# EAGLE design vc8 (EAGLE 6.6.0)
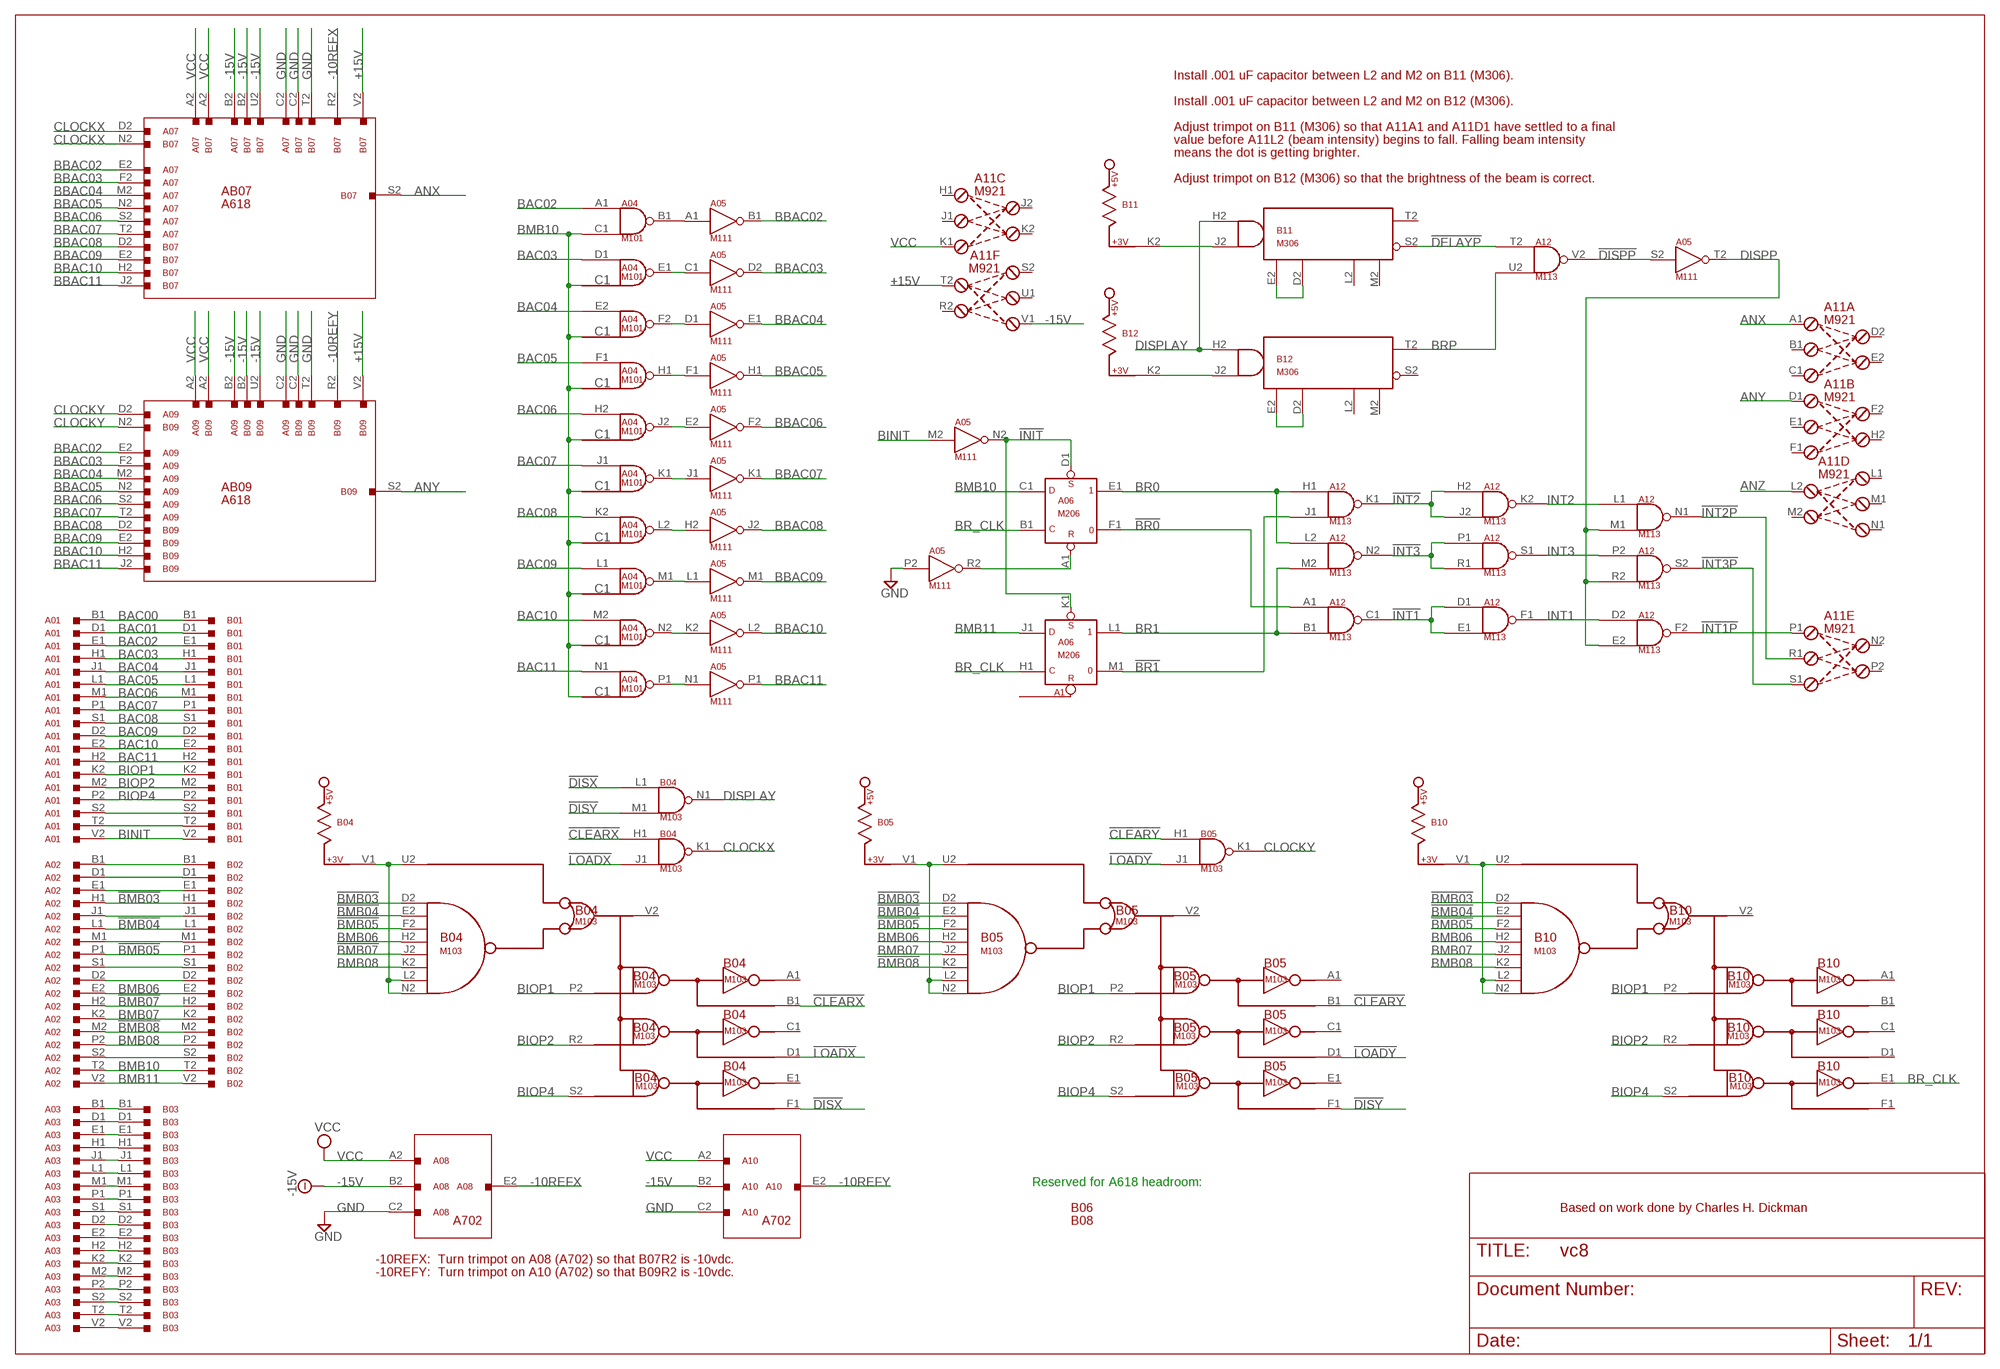
[diagram p0: schematic, sheet 1]

## Parts
A01  M903  [H807]
A02  M903  [H807]
A03  M903  [H807]
A04  M101  [H807]
A05  M111  [H807]
A06  M206  M206X  [H807]
A07  A618A  M916  [H807]
A08  A702  M916  [H807]
A09  A618A  M916  [H807]
A10  A702  M916  [H807]
A11  M921  [H807]
A12  M113  [H807]
B01  M903  [H807]
B02  M903  [H807]
B03  M903  [H807]
B04  M103  [H807]
B05  M103  [H807]
B06  EMPTY  [H807]
B07  A618B  M916  [H807]
B08  EMPTY  [H807]
B09  A618B  M916  [H807]
B10  M103  [H807]
B11  M306  [H807]
B12  M306  [H807]

## Nets
!BMB03: A02.H1 B02.H1 B04.D2(V2:D2) B05.D2(V2:D2) B10.D2(V2:D2)
!BMB04: A02.L1 B02.L1 B04.E2(V2:E2) B05.E2(V2:E2) B10.E2(V2:E2)
!BMB05: A02.P1 B02.P1 B04.F2(V2:F2) B05.F2(V2:F2) B10.F2(V2:F2)
!BMB07: A02.H2 B02.H2 B04.J2(V2:J2)
!BMB08: A02.M2 B02.M2 B05.K2(V2:K2)
!BR0: A06.F1 A12.A1(C1:IN1)
!BR1: A06.M1 A12.J1(K1:IN2)
!CLEARX: B04.B1(V2:B1) B04.H1(K1:IN1)
!CLEARY: B05.B1(V2:B1) B05.H1(K1:IN1)
!DELAYP: A12.T2(V2:IN1) B11.S2(S)
!DISPP: A05.S2(T2:IN) A12.V2(V2:OUT)
!DISX: B04.F1(V2:F1) B04.L1(N1:IN1)
!DISY: B04.M1(N1:IN2) B05.F1(V2:F1)
!INIT: A05.N2(N2:OUT) A06.D1(E1:S) A06.K1(L1:S)
!INT1: A12.C1(C1:OUT) A12.D1(F1:IN1) A12.E1(F1:IN2)
!INT1P: A11.P1(E:L1) A12.F2(F2:OUT)
!INT2: A12.H2(K2:IN1) A12.J2(K2:IN2) A12.K1(K1:OUT)
!INT2P: A11.R1(E:L2) A12.N1(N1:OUT)
!INT3: A12.N2(N2:OUT) A12.P1(S1:IN1) A12.R1(S1:IN2)
!INT3P: A11.S1(E:L3) A12.S2(S2:OUT)
!LOADX: B04.D1(V2:D1) B04.J1(K1:IN2)
!LOADY: B05.D1(V2:D1) B05.J1(K1:IN2)
+3VB04: B04.L2(V2:L2) B04.N2(V2:N2) B04.U2(V2:U2) B04.V1
+3VB05: B05.L2(V2:L2) B05.N2(V2:N2) B05.U2(V2:U2) B05.V1
+3VB10: B10.L2(V2:L2) B10.N2(V2:N2) B10.U2(V2:U2) B10.V1
+15V: A11.T2(F:R1) B07.V2 B09.V2
-10REFX: A08.E2 B07.R2
-10REFY: A10.E2 B09.R2
-15V: A07.B2 A08.B2 A09.B2 A10.B2 A11.V1(F:L3) B07.B2 B07.U2 B09.B2 B09.U2
ANX: A11.A1(A:L1) B07.S2
ANY: A11.D1(B:L1) B09.S2
ANZ: A11.L2(D:R1)
BAC00: A01.B1 B01.B1
BAC01: A01.D1 B01.D1
BAC02: A01.E1 A04.A1(B1:IN1) B01.E1
BAC03: A01.H1 A04.D1(E1:IN) B01.H1
BAC04: A01.J1 A04.E2(F2:IN) B01.J1
BAC05: A01.L1 A04.F1(H1:IN) B01.L1
BAC06: A01.M1 A04.H2(J2:IN) B01.M1
BAC07: A01.P1 A04.J1(K1:IN) B01.P1
BAC08: A01.S1 A04.K2(L2:IN) B01.S1
BAC09: A01.D2 A04.L1(M1:IN) B01.D2
BAC10: A01.E2 A04.M2(N2:IN) B01.E2
BAC11: A01.H2 A04.N1(P1:IN) B01.H2
BBAC02: A05.B1(B1:OUT) A07.E2 A09.E2
BBAC03: A05.D2(D2:OUT) A07.F2 A09.F2
BBAC04: A05.E1(E1:OUT) A07.M2 A09.M2
BBAC05: A05.H1(H1:OUT) A07.N2 A09.N2
BBAC06: A05.F2(F2:OUT) A07.S2 A09.S2
BBAC07: A05.K1(K1:OUT) A07.T2 A09.T2
BBAC08: A05.J2(J2:OUT) B07.D2 B09.D2
BBAC09: A05.M1(M1:OUT) B07.E2 B09.E2
BBAC10: A05.L2(L2:OUT) B07.H2 B09.H2
BBAC11: A05.P1(P1:OUT) B07.J2 B09.J2
BINIT: A01.V2 A05.M2(N2:IN) B01.V2
BIOP1: A01.K2 B01.K2 B04.P2(V2:P2) B05.P2(V2:P2) B10.P2(V2:P2)
BIOP2: A01.M2 B01.M2 B04.R2(V2:R2) B05.R2(V2:R2) B10.R2(V2:R2)
BIOP4: A01.P2 B01.P2 B04.S2(V2:S2) B05.S2(V2:S2) B10.S2(V2:S2)
BMB06: A02.E2 B02.E2 B04.H2(V2:H2) B05.H2(V2:H2) B10.H2(V2:H2)
BMB07: A02.K2 B02.K2 B05.J2(V2:J2) B10.J2(V2:J2)
BMB08: A02.P2 B02.P2 B04.K2(V2:K2) B10.K2(V2:K2)
BMB10: A02.T2 A04.C1(B1:IN2) A06.C1(E1:D) B02.T2
BMB11: A02.V2 A06.J1(L1:D) B02.V2
BR0: A06.E1 A12.H1(K1:IN1) A12.L2(N2:IN1)
BR1: A06.L1 A12.B1(C1:IN2) A12.M2(N2:IN2)
BR_CLK: A06.B1(E1:C) A06.H1(L1:C) B10.E1(V2:E1)
BRP: A12.U2(V2:IN2) B12.T2(T)
CLOCKX: A07.D2 B04.K1(K1:OUT) B07.N2
CLOCKY: A09.D2 B05.K1(K1:OUT) B09.N2
DISPLAY: B04.N1(N1:OUT) B11.H2(H) B12.H2(H)
DISPP: A05.T2(T2:OUT) A12.E2(F2:IN2) A12.M1(N1:IN2) A12.R2(S2:IN2)
GND: A05.P2(R2:IN) A07.C2 A08.C2 A09.C2 A10.C2 B07.C2 B07.T2 B09.C2 B09.T2
INT1: A12.D2(F2:IN1) A12.F1(F1:OUT)
INT2: A12.K2(K2:OUT) A12.L1(N1:IN1)
INT3: A12.P2(S2:IN1) A12.S1(S1:OUT)
N$1: A05.R2(R2:OUT) A06.A1(E1:R)
N$2: B11.J2(J) B11.K2
N$4: B12.J2(J) B12.K2
N$6: B11.D2(D) B11.E2(E)
N$7: B12.D2(D) B12.E2(E)
N$9: A04.B1(B1:OUT) A05.A1(B1:IN)
N$10: A04.E1(E1:OUT) A05.C1(D2:IN)
N$11: A04.F2(F2:OUT) A05.D1(E1:IN)
N$12: A04.H1(H1:OUT) A05.F1(H1:IN)
N$13: A04.J2(J2:OUT) A05.E2(F2:IN)
N$14: A04.P1(P1:OUT) A05.N1(P1:IN)
N$15: A04.N2(N2:OUT) A05.K2(L2:IN)
N$16: A04.M1(M1:OUT) A05.L1(M1:IN)
N$17: A04.L2(L2:OUT) A05.H2(J2:IN)
N$18: A04.K1(K1:OUT) A05.J1(K1:IN)
N$21: A03.B1 B03.B1
N$22: A03.D1 B03.D1
N$23: A03.E1 B03.E1
N$24: A03.H1 B03.H1
N$26: A03.J1 B03.J1
N$27: A03.L1 B03.L1
N$28: A03.M1 B03.M1
N$29: A03.P1 B03.P1
N$30: A03.S1 B03.S1
N$33: A03.D2 B03.D2
N$34: A03.E2 B03.E2
N$35: A03.H2 B03.H2
N$36: A03.K2 B03.K2
N$37: A03.M2 B03.M2
N$38: A03.P2 B03.P2
N$39: A03.S2 B03.S2
N$40: A03.T2 B03.T2
N$41: A03.V2 B03.V2
N$42: A02.D2 B02.D2
N$43: A02.S1 B02.S1
N$44: A02.J1 B02.J1
N$45: A02.M1 B02.M1
N$46: A02.S2 B02.S2
N$47: A02.B1 B02.B1
N$48: A02.D1 B02.D1
N$49: A02.E1 B02.E1
N$50: A01.T2 B01.T2
N$51: A01.S2 B01.S2
VCC: A07.A2 A08.A2 A09.A2 A10.A2 A11.K1(C:L3) B07.A2 B09.A2
Unconnected: A04.P2(R2:IN) A04.R1(S1:IN) A04.R2(R2:OUT) A04.S1(S1:OUT) A04.S2(T2:IN) A04.T2(T2:OUT) A04.U1(U1:OUT) A04.U2(V2:IN) A04.V1(U1:IN) A04.V2(V2:OUT) A05.R1(S1:IN) A05.S1(S1:OUT) A05.U1(U1:OUT) A05.U2(V2:IN) A05.V1(U1:IN) A05.V2(V2:OUT) A06.D2(H2:C) A06.E2(H2:D) A06.F2(H2:S) A06.H2 A06.J2 A06.K2(P2:R) A06.L2(P2:C) A06.M2(P2:D) A06.N1(S1:C) A06.N2(P2:S) A06.P1(S1:D) A06.P2 A06.R1(S1:S) A06.R2 A06.S1 A06.S2(V2:C) A06.T2(V2:D) A06.U1 A06.U2(V2:S) A06.V1 A06.V2 A07.A1 A07.B1 A07.C1 A07.D1 A07.E1 A07.F1 A07.H1 A07.H2 A07.J1 A07.J2 A07.K1 A07.K2 A07.L1 A07.L2 A07.M1 A07.N1 A07.P1 A07.P2 A07.R1 A07.R2 A07.S1 A07.T1 A07.U1 A07.U2 A07.V1 A07.V2 A08.A1 A08.B1 A08.C1 A08.D1 A08.D2 A08.E1 A08.F1 A08.F2 A08.H1 A08.H2 A08.J1 A08.J2 A08.K1 A08.K2 A08.L1 A08.L2 A08.M1 A08.M2 A08.N1 A08.N2 A08.P1 A08.P2 A08.R1 A08.R2 A08.S1 A08.S2 A08.T1 A08.T2 A08.U1 A08.U2 A08.V1 A08.V2 A09.A1 A09.B1 A09.C1 A09.D1 A09.E1 A09.F1 A09.H1 A09.H2 A09.J1 A09.J2 A09.K1 A09.K2 A09.L1 A09.L2 A09.M1 A09.N1 A09.P1 A09.P2 A09.R1 A09.R2 A09.S1 A09.T1 A09.U1 A09.U2 A09.V1 A09.V2 A10.A1 A10.B1 A10.C1 A10.D1 A10.D2 A10.E1 A10.F1 A10.F2 A10.H1 A10.H2 A10.J1 A10.J2 A10.K1 A10.K2 A10.L1 A10.L2 A10.M1 A10.M2 A10.N1 A10.N2 A10.P1 A10.P2 A10.R1 A10.R2 A10.S1 A10.S2 A10.T1 A10.T2 A10.U1 A10.U2 A10.V1 A10.V2 A11.B1(A:L2) A11.C1(A:L3) A11.D2(A:R1) A11.E1(B:L2) A11.E2(A:R2) A11.F1(B:L3) A11.F2(B:R1) A11.H1(C:L1) A11.H2(B:R2) A11.J1(C:L2) A11.J2(C:R1) A11.K2(C:R2) A11.L1(D:L1) A11.M1(D:L2) A11.M2(D:R2) A11.N1(D:L3) A11.N2(E:R1) A11.P2(E:R2) A11.R2(F:R2) A11.S2(F:L1) A11.U1(F:L2) A12.U1 A12.V1 B04.A1(V2:A1) B04.C1(V2:C1) B04.E1(V2:E1) B04.V2(V2:V2) B05.A1(V2:A1) B05.C1(V2:C1) B05.E1(V2:E1) B05.L1(N1:IN1) B05.M1(N1:IN2) B05.N1(N1:OUT) B05.V2(V2:V2) B07.A1 B07.B1 B07.C1 B07.D1 B07.E1 B07.F1 B07.F2 B07.H1 B07.J1 B07.K1 B07.K2 B07.L1 B07.L2 B07.M1 B07.M2 B07.N1 B07.P1 B07.P2 B07.R1 B07.S1 B07.T1 B07.U1 B07.V1 B09.A1 B09.B1 B09.C1 B09.D1 B09.E1 B09.F1 B09.F2 B09.H1 B09.J1 B09.K1 B09.K2 B09.L1 B09.L2 B09.M1 B09.M2 B09.N1 B09.P1 B09.P2 B09.R1 B09.S1 B09.T1 B09.U1 B09.V1 B10.A1(V2:A1) B10.B1(V2:B1) B10.C1(V2:C1) B10.D1(V2:D1) B10.F1(V2:F1) B10.H1(K1:IN1) B10.J1(K1:IN2) B10.K1(K1:OUT) B10.L1(N1:IN1) B10.M1(N1:IN2) B10.N1(N1:OUT) B10.V2(V2:V2) B11.L2(L) B11.M2(M) B11.T2(T) B12.L2(L) B12.M2(M) B12.S2(S)

## Notes on the sheet
- Install .001 uF capacitor between L2 and M2 on B11 (M306).
- Install .001 uF capacitor between L2 and M2 on B12 (M306).
- Adjust trimpot on B11 (M306) so that A11A1 and A11D1 have settled to a final
- value before A11L2 (beam intensity) begins to fall. Falling beam intensity
- means the dot is getting brighter.
- Adjust trimpot on B12 (M306) so that the brightness of the beam is correct.
- AB07
- A618
- AB09
- A618
- Reserved for A618 headroom:
- Based on work done by Charles H. Dickman
- A702 | A702
- -10REFX:  Turn trimpot on A08 (A702) so that B07R2 is -10vdc.
- -10REFY:  Turn trimpot on A10 (A702) so that B09R2 is -10vdc.

## Power pins joined to a net without a drawn wire
-15V: B06.B2 B08.B2
GND: A01.A1 A01.C1 A01.C2 A01.F1 A01.F2 A01.J2 A01.K1 A01.L2 A01.N1 A01.N2 A01.R1 A01.R2 A01.T1 A01.U2 A02.A1 A02.C1 A02.C2 A02.F1 A02.F2 A02.J2 A02.K1 A02.L2 A02.N1 A02.N2 A02.R1 A02.R2 A02.T1 A02.U2 A03.A1 A03.C1 A03.C2 A03.F1 A03.F2 A03.J2 A03.K1 A03.L2 A03.N1 A03.N2 A03.R1 A03.R2 A03.T1 A03.U2 A04.C2(GND) A04.T1(GND) A05.C2(GND) A05.T1(GND) A06.C2(GND) A06.T1(GND) A12.C2(GND) A12.T1(GND) B01.A1 B01.C1 B01.C2 B01.F1 B01.F2 B01.J2 B01.K1 B01.L2 B01.N1 B01.N2 B01.R1 B01.R2 B01.T1 B01.U2 B02.A1 B02.C1 B02.C2 B02.F1 B02.F2 B02.J2 B02.K1 B02.L2 B02.N1 B02.N2 B02.R1 B02.R2 B02.T1 B02.U2 B03.A1 B03.C1 B03.C2 B03.F1 B03.F2 B03.J2 B03.K1 B03.L2 B03.N1 B03.N2 B03.R1 B03.R2 B03.T1 B03.U2 B04.C2(GND) B04.T1(GND) B05.C2(GND) B05.T1(GND) B06.C2 B08.C2 B10.C2(GND) B10.T1(GND) B11.C2(GND) B12.C2(GND)
VCC: A04.A2(VCC) A05.A2(VCC) A06.A2(VCC) A12.A2(VCC) B04.A2(VCC) B05.A2(VCC) B06.A2 B08.A2 B10.A2(VCC) B11.A2(VCC) B12.A2(VCC)

## Library data of the parts
A01-A03 B01-B03 = dec-m:M903: Two-sided Posibus cable/connector.
A04 = dec-m:M101: Bus Data Interface The M101 contains 15 two-input NAND gates. One input of each gate is tied to a common line so that all data signals can be enabled simultaneously. Each data signal presents one TTL load. The common input presents 15 loads. Each output can drive 10 loads. Power: 5V@82ma (max.)
A05 = dec-m:M111: Sixteen inverters.
A06 = dec-m:M206X: Two sets of 3 D flip-flops
A07-A09 A10 B07 B09 = dec-m:M916: Simple 36 pin connector/wire cable
A11 = dec-m:M921: Device Code Select Jumper Board
A12 = dec-m:M113: 10 2-input NAND Gates
B04 B05 B10 = dec-m:M103: M103 Device Selector Used to decode IOT requests.
B06 B08 = dec-m:EMPTY: Empty Slot
B11 B12 = dec-m:M306: M306 Integrating One-Shot

## Net classes
1 Supply: width 0.635 mm

## Board
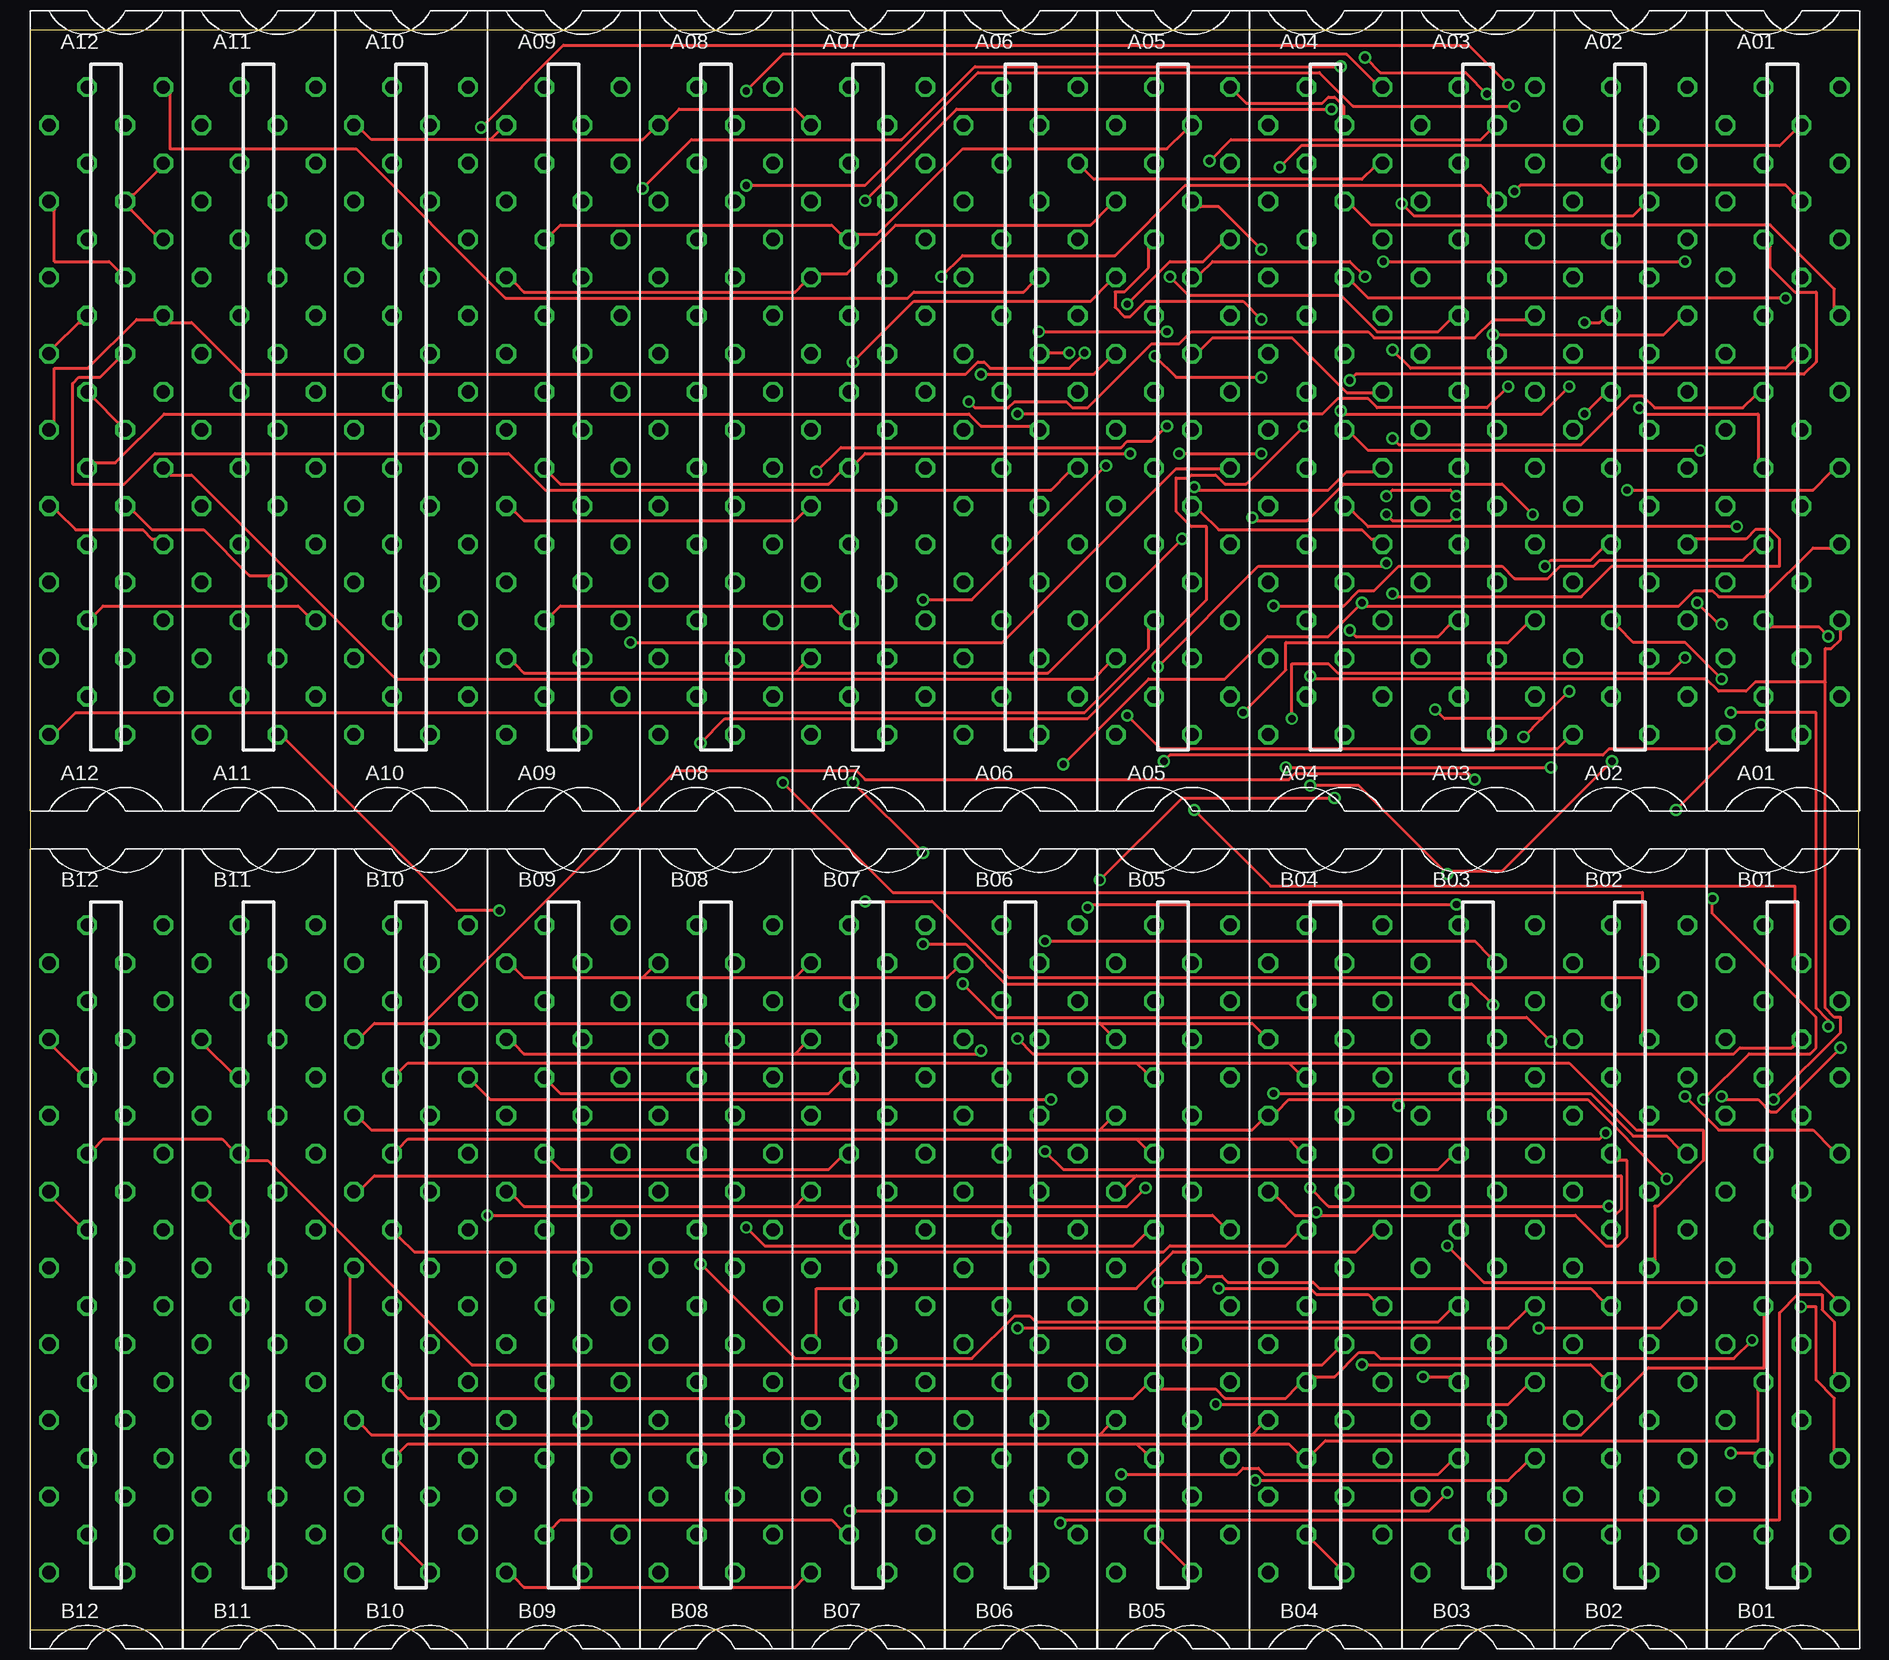
[diagram p1: board, top side]
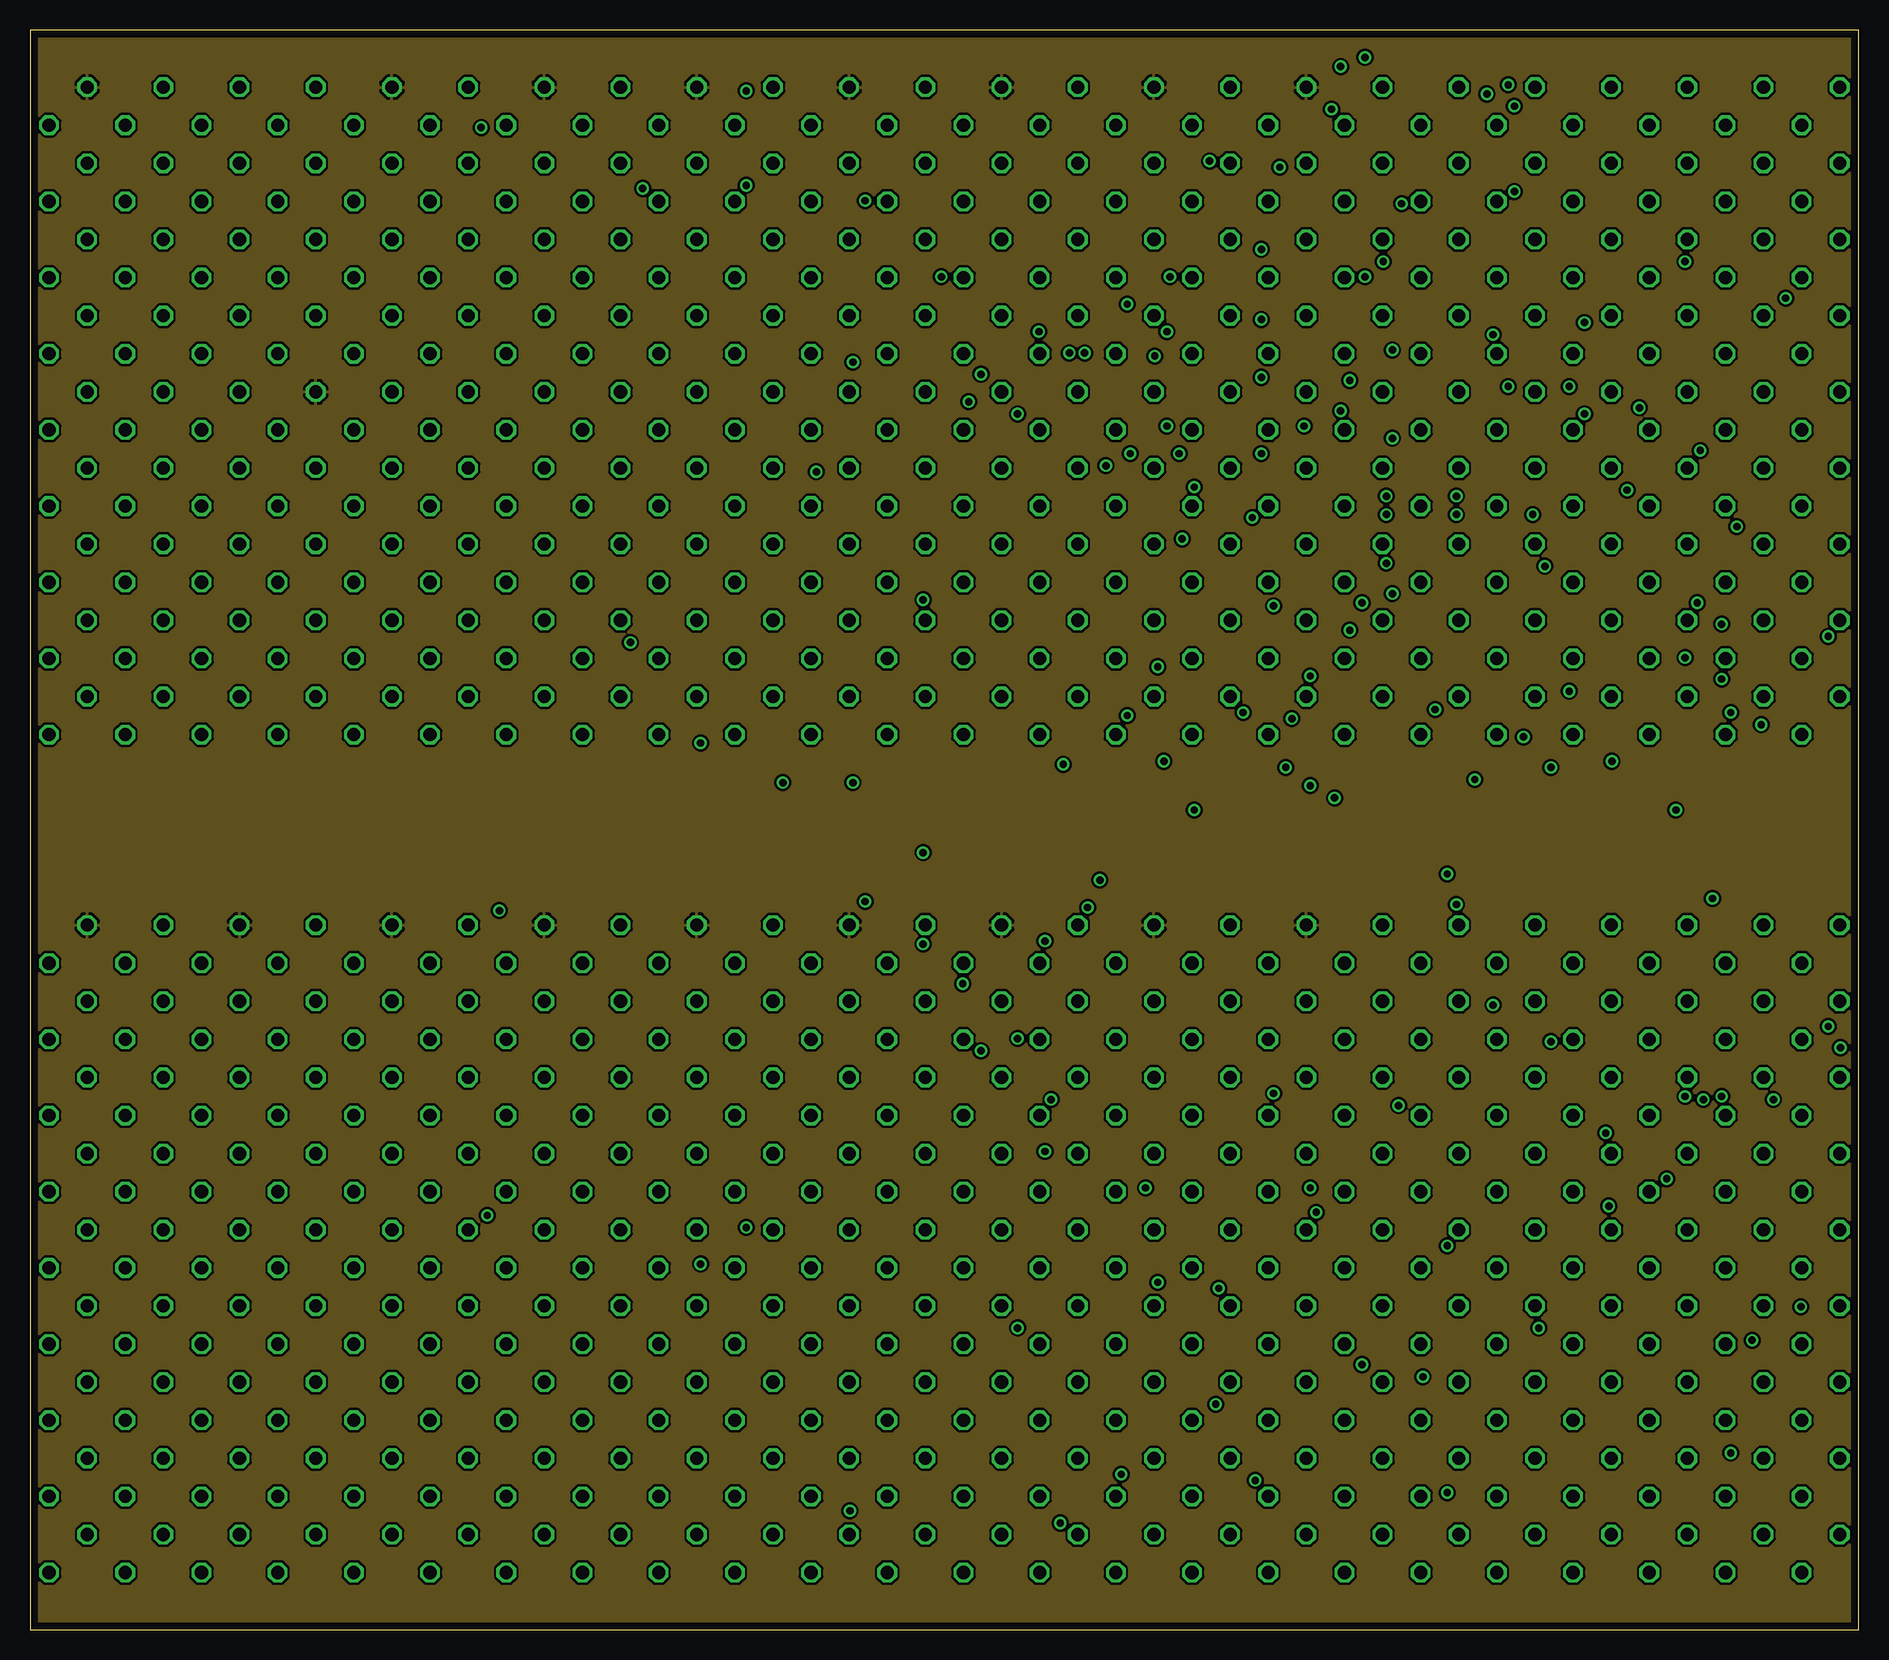
[diagram p2: board, inner layer vcc$]
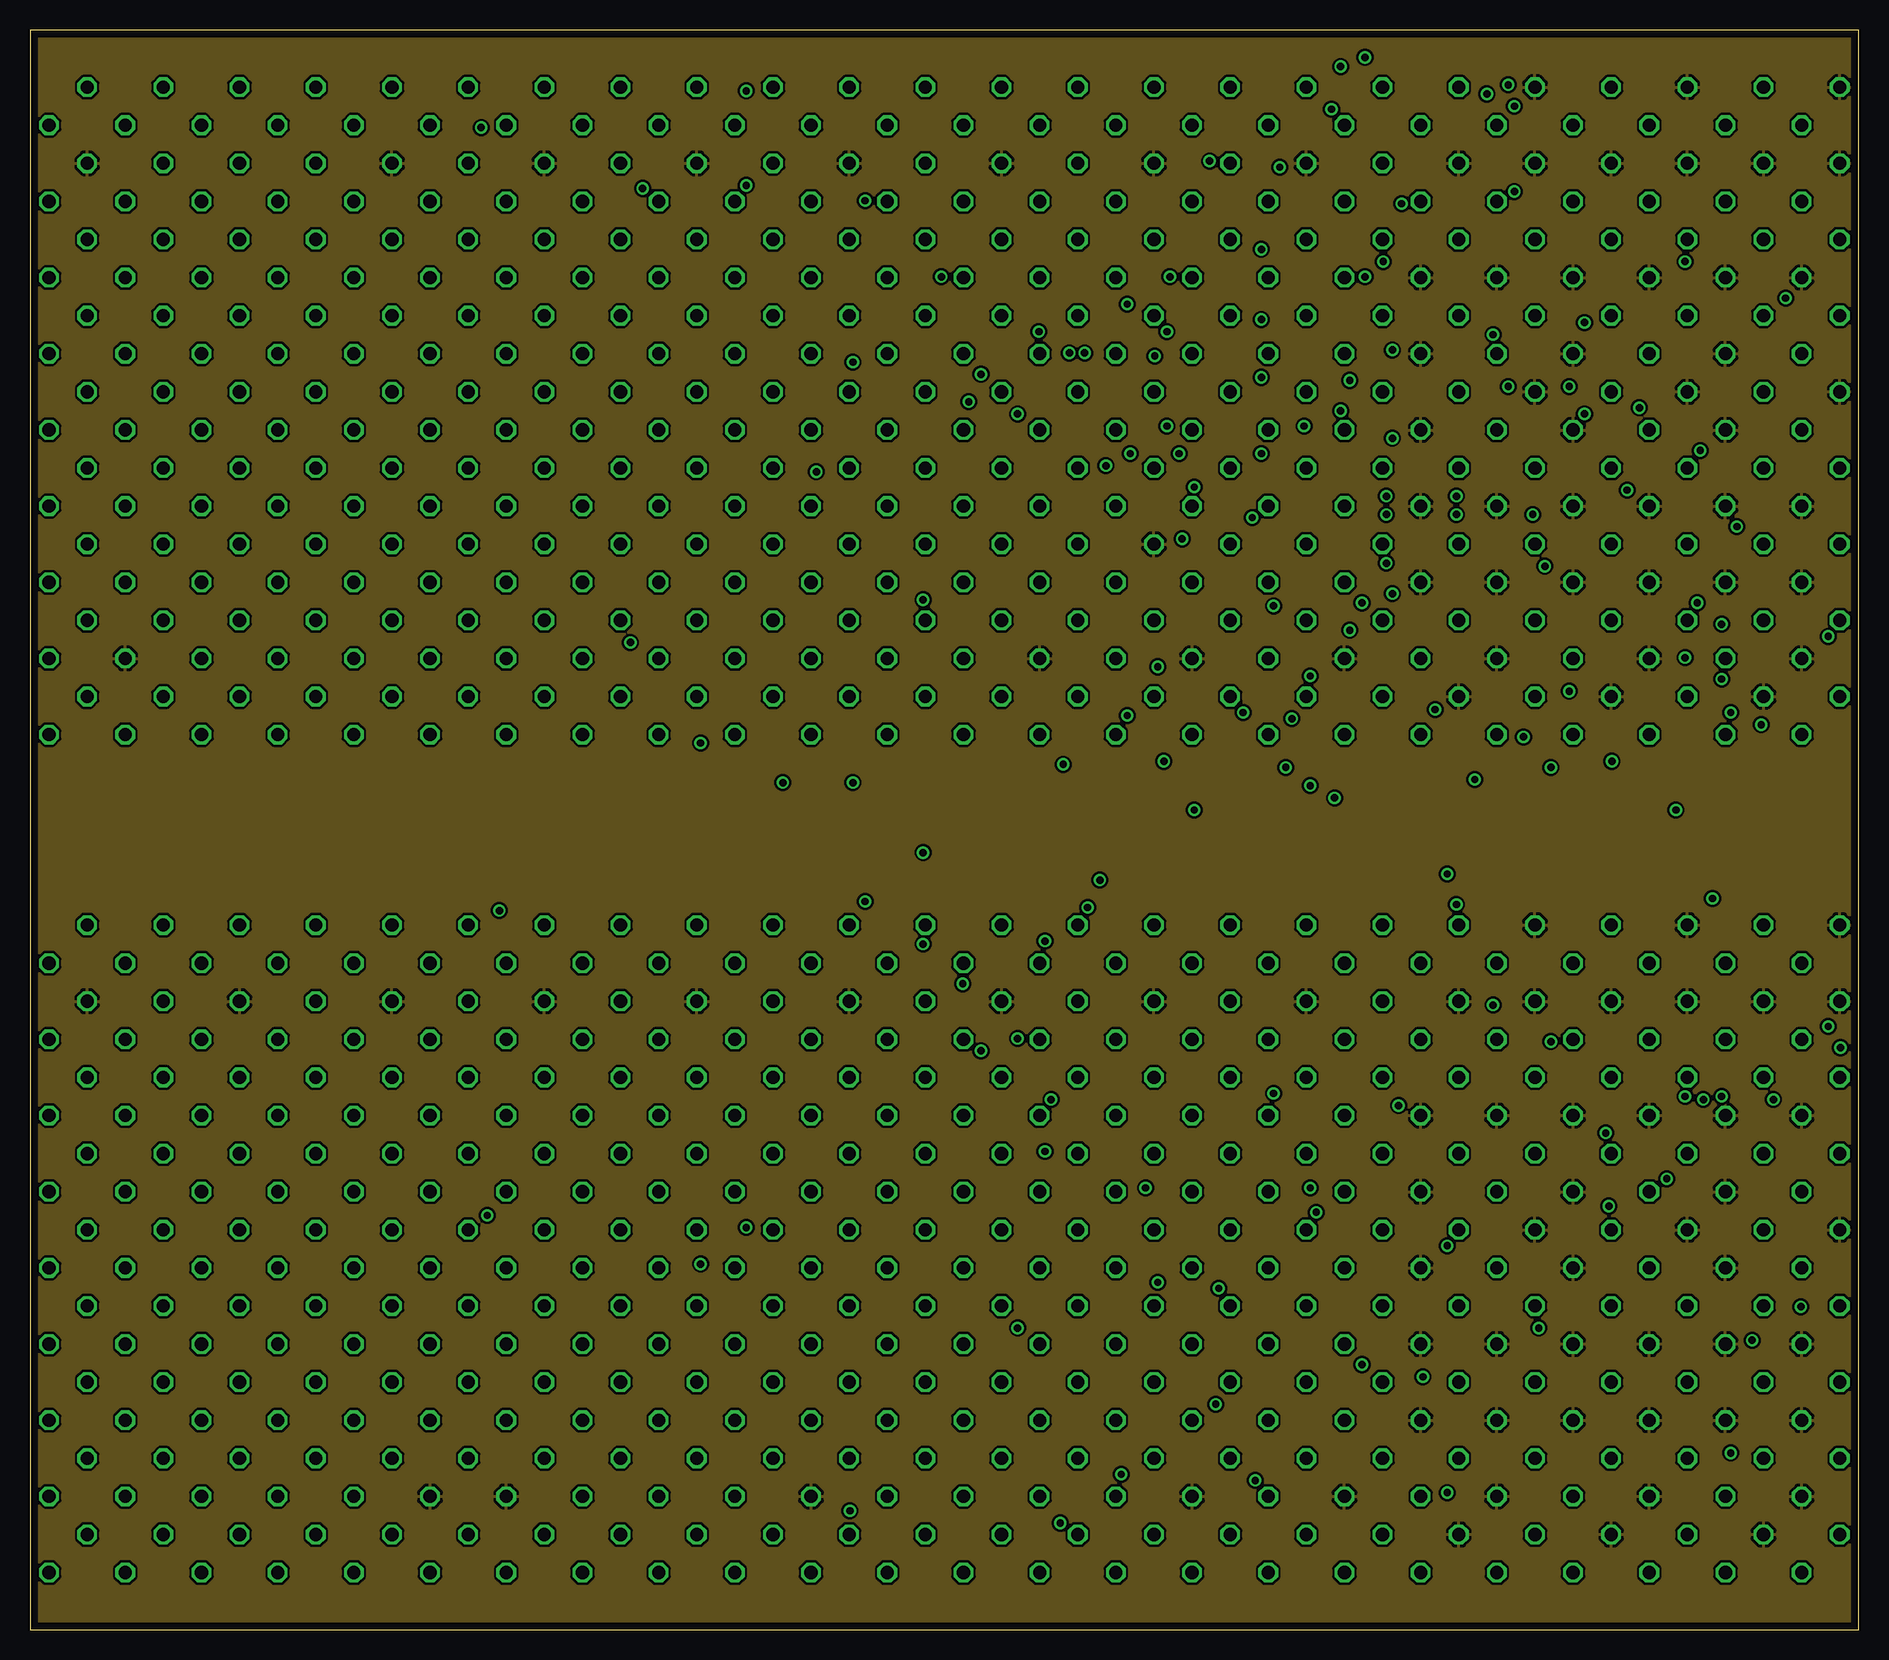
[diagram p3: board, inner layer gnd$]
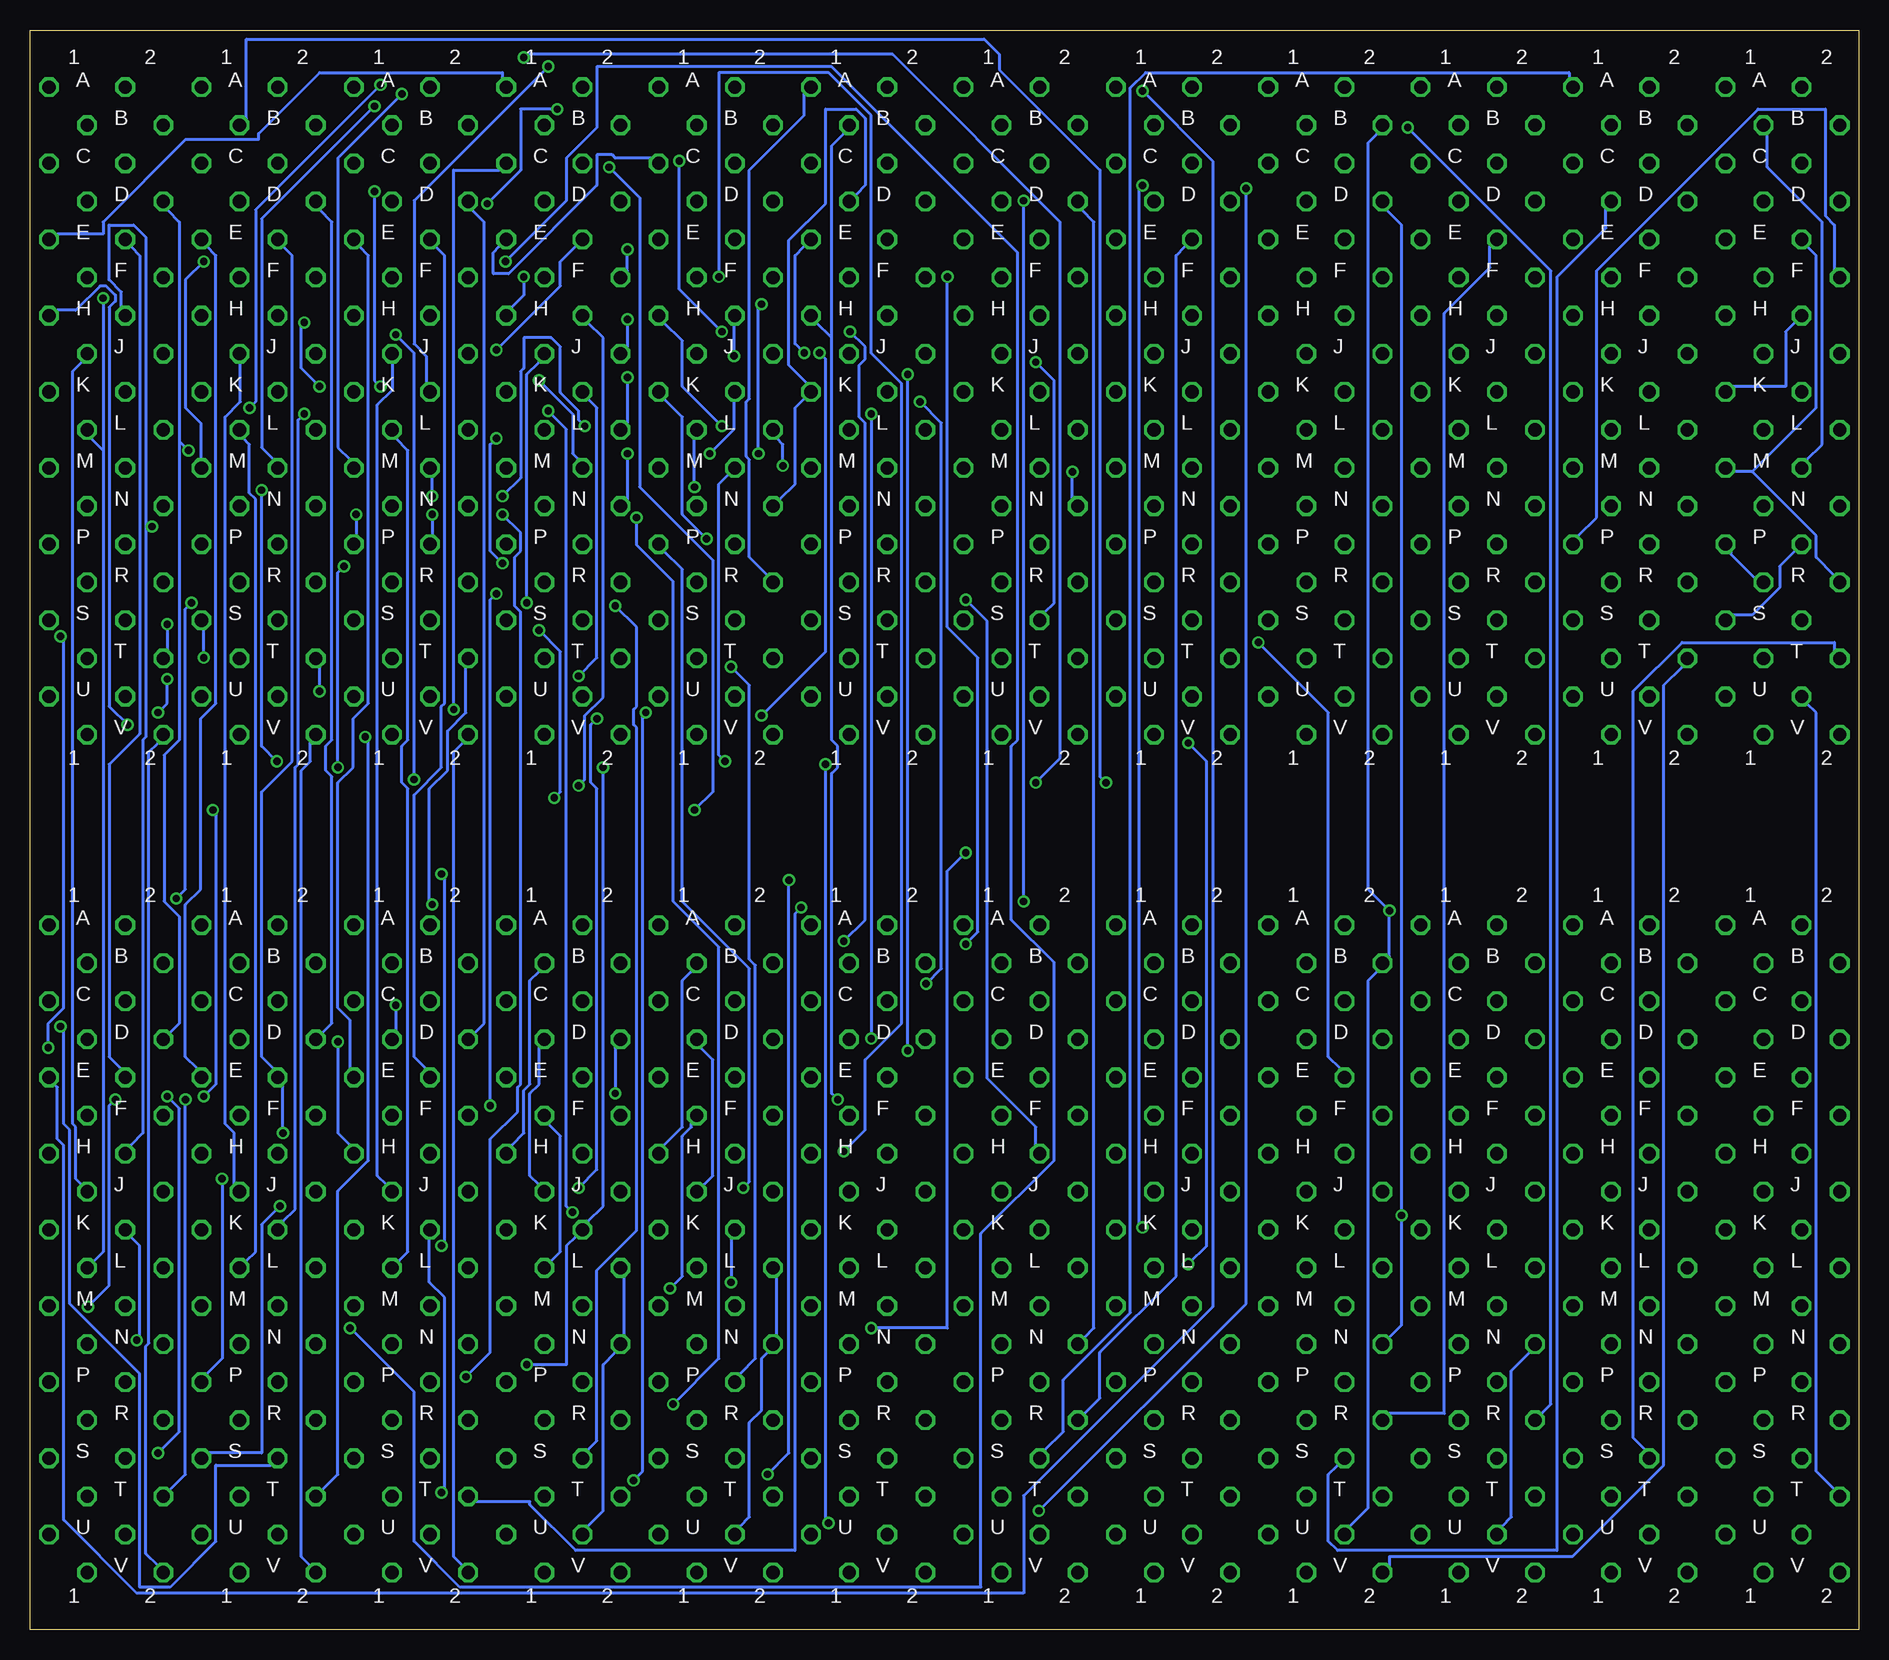
[diagram p4: board, bottom side, seen from below]

Size 152.4 x 133.35 mm. Coordinates in mm from the lower left corner, seen from the top.
Outline: 0,0 152.4,0 152.4,133.35 0,133.35 0,0
Copper layers (1*2*15*16): Top 0.035mm / dielectric 1.5mm / vcc$ 0.035mm / dielectric 0.15mm / gnd$ 0.035mm / dielectric 0.2mm / Bottom 0.035mm
Design rules "custompcb *": minimum track width 10mil, minimum drill 24mil, track to track 8mil, track to pad 8mil, pad to pad 8mil, via to via 8mil, smd to smd 0mil, copper to edge 25mil, drill to drill 8mil, minimum pad ring 10mil, minimum via ring 8mil, stop-mask expansion 4mil, vias tented up to drill 0mil, thermal gap 10mil

### Footprints (pad centres in the part's own frame; a part is rotated, then mirrored left to right if it is on the bottom)
H807 = drill 1.092 octagon: A1 4.763,28.575; A2 -1.587,28.575; B1 1.587,25.4; B2 -4.763,25.4; C1 4.763,22.225; C2 -1.587,22.225; D1 1.587,19.05; D2 -4.763,19.05; E1 4.763,15.875; E2 -1.587,15.875; F1 1.587,12.7; F2 -4.763,12.7; H1 4.763,9.525; H2 -1.587,9.525; J1 1.587,6.35; J2 -4.763,6.35; K1 4.763,3.175; K2 -1.587,3.175; L1 1.587,0; L2 -4.763,0; M1 4.763,-3.175; M2 -1.587,-3.175; N1 1.587,-6.35; N2 -4.763,-6.35; P1 4.763,-9.525; P2 -1.587,-9.525; R1 1.587,-12.7; R2 -4.763,-12.7; S1 4.763,-15.875; S2 -1.587,-15.875; T1 1.587,-19.05; T2 -4.763,-19.05; U1 4.763,-22.225; U2 -1.587,-22.225; V1 1.587,-25.4; V2 -4.763,-25.4

### Placement (x,y rotation side)
A01  146.05,100.01 0 top
A02  133.35,100.01 0 top
A03  120.65,100.01 0 top
A04  107.95,100.01 0 top
A05  95.25,100.01 0 top
A06  82.55,100.01 0 top
A07  69.85,100.01 0 top
A08  57.15,100.01 0 top
A09  44.45,100.01 0 top
A10  31.75,100.01 0 top
A11  19.05,100.01 0 top
A12  6.35,100.01 0 top
B01  146.05,30.16 0 top
B02  133.35,30.16 0 top
B03  120.65,30.16 0 top
B04  107.95,30.16 0 top
B05  95.25,30.16 0 top
B06  82.55,30.16 0 top
B07  69.85,30.16 0 top
B08  57.15,30.16 0 top
B09  44.45,30.16 0 top
B10  31.75,30.16 0 top
B11  19.05,30.16 0 top
B12  6.35,30.16 0 top

### Tracks (layer width: path | path; a pad name or v marks a point on that pad's centre or on a via)
!BMB03  (via drill 0.61)
  Top 0.254: 32.77,50.55 89.15,50.55 | 32.77,50.55 28.7,50.55 27.69,49.53 B10.D2 | 89.15,50.55 89.92,49.78 B05.D2 | 89.15,50.55 101.85,50.55 102.62,49.78 B04.D2 | v103.63,44.7 130.05,44.7 133.6,41.15 136.4,41.15 137.41,40.13 B02.H1 | v121.92,107.95 136.14,107.95 137.41,109.22 A02.H1 | v120.4,70.87 119.89,71.37 105.41,71.37 104.9,70.87 69.6,70.87 68.83,71.63 53.85,71.63 32.77,50.55
  Bottom 0.254: v103.63,44.7 103.63,48.51 B04.D2 | v121.92,107.95 120.4,106.43 v120.4,70.87
!BMB04
  Top 0.254: 92.2,47.24 31.5,47.24 30.73,46.48 B10.E2 | 92.2,47.24 92.96,46.48 B05.E2 | 104.9,47.24 105.66,46.48 B04.E2 | 92.2,47.24 104.9,47.24 | 104.9,47.24 128.27,47.24 133.86,41.66 139.45,41.66 139.45,39.12 135.64,35.31 135.38,35.31 135.38,30.73 B02.L1
  Bottom 0.254: A02.L1 134.62,99.31 134.11,98.81 134.11,94.74 133.6,94.23 133.6,31.5 134.37,30.73 B02.L1
!BMB05  (via drill 0.61)
  Top 0.254: 89.15,41.66 28.45,41.66 27.69,42.42 B10.F2 | 89.15,41.66 89.92,42.42 B05.F2 | 89.15,41.66 101.85,41.66 102.62,42.42 B04.F2 103.89,43.18 104.9,44.2 114.05,44.2 | v136.4,37.59 129.79,44.2 114.05,44.2 | v113.54,86.36 113.79,86.11 129.29,86.11 131.83,88.65 145.8,88.65 145.8,90.93 145.03,91.69 143.76,91.69 143,90.93 138.68,90.93 A02.P1 | 114.05,44.2 v114.05,43.69
  Bottom 0.254: v136.4,37.59 136.4,22.61 137.67,21.34 B02.P1 | v113.54,86.36 114.05,85.85 v114.05,43.69
!BMB07  (via drill 0.61)
  Top 0.254: 107.19,34.54 128.78,34.54 131.32,32 132.33,32 133.1,32.77 133.1,39.12 132.33,39.12 B02.H2 | 107.19,34.54 105.41,34.54 103.89,36.07 B04.J2 | v129.54,108.97 130.81,108.97 131.06,109.22 A02.H2 | v128.27,103.63 125.98,101.35 109.47,101.35 v109.22,101.6 | 107.19,34.54 v107.19,34.8
  Bottom 0.254: v129.54,108.97 129.79,108.71 129.79,105.16 v128.27,103.63 | v109.22,101.6 107.7,100.08 107.7,35.31 v107.19,34.8
!BMB08  (via drill 0.61)
  Top 0.254: v93.98,28.96 97.54,28.96 98.04,29.46 99.31,29.46 99.82,28.96 106.93,28.96 107.44,28.45 130.05,28.45 131.06,27.43 B02.M2 | v123.7,127 110.24,127 107.44,129.79 78.99,129.79 69.6,120.4 v59.69,120.4 | v59.69,33.53 61.21,32 91.95,32 92.96,33.02 B05.K2
  Bottom 0.254: v93.98,28.96 93.98,32.77 B05.K2 | v123.7,127 133.1,117.6 133.1,98.55 132.08,97.54 A02.M2 | v59.69,120.4 59.94,120.14 59.94,33.78 v59.69,33.53
!BR0
  Top 0.254: A12.A1 11.68,128.02 11.68,123.44 27.18,123.44 39.62,111 73.15,111 73.66,111.51 82.8,111.51 83.57,112.27 A06.F1
!BR1
  Top 0.254: A12.J1 7.37,105.92 5.84,104.39 4.06,104.39 3.56,103.89 3.56,95.5 7.87,95.5 10.41,98.04 39.88,98.04 42.93,95 85.09,95 86.61,96.52 A06.M1
!CLEARX
  Bottom 0.254: B04.H1 112.27,40.39 111.25,41.4 111.25,44.96 110.74,45.47 110.74,54.1 109.98,54.86 B04.B1
!CLEARY
  Bottom 0.254: B05.H1 99.57,40.39 98.04,41.91 98.04,54.1 97.28,54.86 B05.B1
!DELAYP
  Bottom 0.254: B11.S2 17.78,14.99 18.8,16 18.8,78.23 14.73,82.3 2.03,82.3 2.03,81.53 A12.T2
!DISPP
  Top 0.254: A12.V2 2.29,74.93 3.81,76.45 87.88,76.45 93.22,81.79 93.22,83.57 A05.S2
!DISX
  Bottom 0.254: B04.L1 108.97,30.73 108.2,31.5 108.2,41.15 109.22,42.16 B04.F1
!DISY  (via drill 0.61)
  Top 0.254: v99.06,28.45 106.68,28.45 107.19,27.94 111.51,27.94 112.01,27.43 B04.M1
  Bottom 0.254: v99.06,28.45 98.04,29.46 98.04,41.15 97.28,41.91 97.28,42.16 B05.F1
!INIT
  Bottom 0.254: A05.N2 89.92,94.23 88.65,95.5 88.65,101.85 87.88,102.62 A06.K1 87.63,103.89 89.15,105.41 89.15,115.82 86.11,118.87 86.11,126.75 83.57,126.75 82.8,125.98 82.8,120.4 83.57,119.63 A06.D1
!INT1
  Top 0.254: A12.E1 10.41,116.33 8.38,118.36 A12.D1 8.38,119.63 8.64,119.63 10.67,121.67 A12.C1
!INT1P
  Bottom 0.254: A11.P1 23.37,91.19 21.84,92.71 21.84,113.28 8.38,126.75 2.79,126.75 2.79,117.86 2.03,117.09 2.03,113.28 A12.F2
!INT2
  Top 0.254: A12.J2 2.03,106.93 4.06,108.97 4.32,108.97 A12.H2
  Bottom 0.254: A12.K1 10.41,103.63 6.1,103.63 6.1,108.2 5.33,108.97 A12.H2
!INT2P
  Top 0.254: A12.N1 8.64,93.22 10.16,91.69 14.48,91.69 18.29,87.88 20.07,87.88 A11.R1
!INT3
  Top 0.254: A12.N2 2.29,93.22 3.81,91.69 9.4,91.69 10.16,90.93 10.41,90.93 A12.P1
  Bottom 0.254: A12.R1 8.64,87.63 10.67,89.66 10.67,89.92 A12.P1
!INT3P
  Top 0.254: A12.S2 5.33,84.58 6.1,85.34 22.35,85.34 23.11,84.58 A11.S1
!LOADX
  Bottom 0.254: B04.J1 109.98,37.08 110.74,37.85 110.74,44.7 109.98,45.47 109.98,48.51 B04.D1
!LOADY
  Bottom 0.254: B05.J1 96.27,37.08 95.5,37.85 95.5,47.5 96.52,48.51 B05.D1
+3VB04
  Top 0.254: B04.U2 106.93,7.37 108.97,5.33 B04.V1
  Bottom 0.254: B04.L2 102.87,29.46 102.87,24.38 B04.N2 103.63,23.11 104.65,22.1 104.65,9.91 105.92,8.64 B04.U2
+3VB05
  Top 0.254: B05.U2 94.23,7.37 96.27,5.33 B05.V1
  Bottom 0.254: B05.L2 90.17,29.46 90.17,24.38 B05.N2 90.93,23.11 91.44,22.61 91.44,18.29 92.46,17.27 92.46,9.4 93.22,8.64 B05.U2
+3VB10
  Top 0.254: B10.N2 26.67,24.38 26.67,29.46 B10.L2 | B10.U2 30.73,7.37 32.77,5.33 B10.V1
  Bottom 0.254: B10.N2 27.43,23.11 28.96,21.59 28.96,9.4 29.72,8.64 B10.U2
+15V
  Top 0.254: B09.V2 40.39,4.32 41.15,3.56 63.75,3.56 64.52,4.32 B07.V2
  Bottom 0.254: A11.T2 14.73,80.26 16.26,78.74 16.26,13.72 23.88,6.1 39.12,6.1 39.12,5.33 B09.V2
-10REFX
  Bottom 0.254: B07.R2 64.52,18.03 63.25,19.3 63.25,23.11 56.9,29.46 56.9,114.55 56.13,115.32 A08.E2
-10REFY
  Bottom 0.254: B09.R2 39.12,18.03 34.54,18.03 34.54,109.73 30.73,113.54 30.73,115.32 A10.E2
-15V  (via drill 0.61)
  Top 0.254: 38.35,124.21 28.45,124.21 27.69,124.97 A10.B2 | 38.35,124.21 39.12,124.97 A09.B2 | 38.35,124.21 51.05,124.21 51.82,124.97 A08.B2 53.09,125.73 54.1,126.75 63.75,126.75 64.52,125.98 A07.B2 | B09.U2 43.43,8.38 44.2,9.14 66.8,9.14 67.56,8.38 B07.U2 | 51.05,54.36 41.15,54.36 40.39,55.12 B09.B2 | 51.05,54.36 51.82,55.12 B08.B2 | 63.75,54.36 64.52,55.12 B07.B2 | 51.05,54.36 63.75,54.36 | 63.75,54.36 76.45,54.36 77.22,55.12 B06.B2 | v39.12,59.94 35.56,59.94 21.34,74.17 A11.V1
  Bottom 0.254: B09.U2 42.42,8.64 40.89,10.16 40.89,54.1 40.13,54.86 B09.B2 39.12,56.13 v39.12,59.94 39.37,60.2 40.89,61.72 40.89,123.95 40.13,124.71 A09.B2
ANX
  Bottom 0.254: B07.S2 67.82,14.99 66.29,16.51 66.29,20.83 60.71,26.42 60.71,128.52 59.44,129.79 24.13,129.79 24.13,129.29 A11.A1
ANY
  Bottom 0.254: B09.S2 43.43,13.72 44.2,12.95 44.2,7.37 43.43,6.6 25.15,6.6 25.15,112.78 21.08,116.84 21.08,118.36 A11.D1
BAC00  (via drill 0.61)
  Top 0.254: v97.03,68.33 103.38,61.98 147.07,61.98 147.07,56.13 B01.B1 | v104.14,121.92 105.92,123.7 145.8,123.7 147.07,124.97 A01.B1
  Bottom 0.254: v97.03,68.33 95.5,69.85 95.5,89.15 101.6,95.25 101.6,119.38 v104.14,121.92
BAC01  (via drill 0.61)
  Top 0.254: v82.3,49.28 83.57,48.01 141.99,48.01 142.49,48.51 146.81,48.51 147.07,48.77 B01.D1 | v82.3,101.35 107.7,101.35 108.97,102.62 111.51,102.62 112.27,101.85 121.41,101.85 v123.19,103.63 | v123.7,119.89 124.21,120.4 146.3,120.4 147.07,119.63 A01.D1
  Bottom 0.254: v82.3,101.35 v82.3,49.28 | v123.19,103.63 123.7,104.14 v123.7,119.89
BAC02  (via drill 0.61)
  Top 0.254: v59.69,128.27 62.74,131.32 109.73,131.32 112.01,129.03 A04.A1
  Bottom 0.254: v59.69,128.27 53.85,122.43 53.85,26.92 69.6,11.18 69.6,3.05 143.51,3.05 149.61,9.14 149.61,40.39 150.11,40.89 150.11,45.21 150.37,45.47 B01.E1 | A01.E1 150.11,116.33 146.3,116.33 146.3,117.35 139.45,124.21 133.35,124.21 133.35,124.71 128.27,129.79 113.03,129.79 113.03,129.29 A04.A1
BAC03  (via drill 0.61)
  Top 0.254: v137.92,44.45 140.72,41.66 148.59,41.66 150.11,40.13 B01.H1 | v144.27,75.44 v137.16,68.33 | A04.D1 110.24,118.62 111.76,117.09 145.03,117.09 150.37,111.76 150.37,110.24 A01.H1
  Bottom 0.254: v137.92,44.45 136.91,45.47 136.91,68.07 v137.16,68.33 | v144.27,75.44 145.8,76.96 145.8,110.24 145.29,110.74 145.29,111.25 146.05,112.01 146.56,112.01 148.59,109.98 150.11,109.98 A01.H1
BAC04  (via drill 0.61)
  Top 0.254: v113.54,106.68 115.06,105.16 146.3,105.16 147.07,105.92 A01.J1
  Bottom 0.254: B01.J1 148.08,37.08 148.59,37.59 148.59,41.91 148.84,42.16 148.84,104.9 148.08,105.66 A01.J1 | v113.54,106.68 108.2,112.01 108.2,114.05 106.93,115.32 A04.E2
BAC05  (via drill 0.61)
  Top 0.254: v146.3,111 111.51,111 110.24,112.27 A04.F1
  Bottom 0.254: 146.3,98.3 146.3,31.5 147.07,30.73 B01.L1 | 146.3,98.3 147.32,99.31 A01.L1 | v146.3,111 146.3,98.3
BAC06  (via drill 0.61)
  Top 0.254: v118.11,32 121.16,28.96 149.1,28.96 150.37,27.69 B01.M1 | v106.68,70.36 110.74,70.36 v118.11,62.99 118.36,63.25 122.68,63.25 v131.83,72.39 | v133.1,95 148.59,95 150.11,96.52 A01.M1
  Bottom 0.254: v118.11,32 117.86,32.26 117.86,62.74 v118.11,62.99 | v106.68,70.36 106.17,70.87 106.17,76.2 104.65,77.72 104.65,107.7 105.92,108.97 A04.H2 | v133.1,95 133.1,73.66 v131.83,72.39
BAC07  (via drill 0.61)
  Top 0.254: A01.P1 150.11,90.17 148.59,90.17 144.53,86.11 140.72,86.11 140.21,86.61 138.68,86.61 137.41,85.34 111.25,85.34 v111,85.6 110.74,85.34 108.2,82.8 103.12,82.8 99.57,79.25 93.22,79.25 v86.11,72.14 | v85.85,8.89 86.11,9.14 145.8,9.14 145.8,26.42 147.32,27.94 149.35,27.94 149.35,26.67 150.37,25.65 150.37,21.34 B01.P1
  Bottom 0.254: v111,85.6 111,104.65 109.98,105.66 A04.J1 | v85.85,8.89 86.11,9.14 v86.11,72.14
BAC08  (via drill 0.61)
  Top 0.254: v147.57,26.92 148.84,26.92 148.84,20.83 150.37,19.3 150.37,14.99 B01.S1 | v145.29,44.2 150.88,49.78 150.88,51.05 150.37,51.05 149.61,51.82 149.61,78.99 | 149.61,78.99 149.61,81.79 150.11,81.79 150.88,82.55 150.88,83.57 A01.S1 | v106.68,79.5 106.93,79.25 139.7,79.25 140.72,78.23 143,78.23 143.76,78.99 149.61,78.99
  Bottom 0.254: v147.57,26.92 145.8,28.7 145.8,43.69 v145.29,44.2 | v106.68,79.5 105.16,81.03 105.16,101.85 105.92,102.62 A04.K2
BAC09  (via drill 0.61)
  Top 0.254: v139.19,98.3 111.51,98.3 110.24,99.57 A04.L1
  Bottom 0.254: 139.95,99.06 v139.19,98.3 | 139.95,99.06 139.95,117.35 140.97,118.36 A01.D2 | 139.95,99.06 139.95,74.17 141.22,72.9 141.22,60.71 139.95,59.44 139.95,50.55 140.72,49.78 B01.D2
BAC10  (via drill 0.61)
  Top 0.254: v109.98,104.14 110.49,104.65 147.83,104.65 148.84,105.66 148.84,111.51 147.07,111.51 145.03,113.54 145.03,115.32 A01.E2
  Bottom 0.254: v109.98,104.14 107.19,101.35 107.19,98.04 106.68,97.54 A04.M2 | B01.E2 144.78,46.74 145.8,47.75 145.8,72.14 143.26,74.68 143.26,114.55 144.02,115.32 A01.E2
BAC11  (via drill 0.61)
  Top 0.254: v142.24,91.95 111.51,91.95 110.24,93.22 A04.N1
  Bottom 0.254: 142.75,91.95 142.75,116.08 143.76,117.09 145.8,117.09 145.8,112.52 144.78,111.51 144.78,110.24 A01.H2 | 142.75,91.95 142.75,74.42 143,74.17 143,41.4 144.02,40.39 B01.H2 | 142.75,91.95 v142.24,91.95
BBAC02
  Top 0.254: A09.E2 43.43,116.33 44.2,117.09 66.8,117.09 67.56,116.33 A07.E2 68.83,116.33 70.61,116.33 77.72,123.44 94.74,123.44 96.27,124.97 A05.B1
BBAC03
  Top 0.254: A09.F2 40.39,112.27 41.15,111.51 63.75,111.51 64.52,112.27 A07.F2 65.79,113.03 68.07,113.03 72.14,117.09 88.39,117.09 89.92,118.62 A05.D2
BBAC04  (via drill 0.61)
  Top 0.254: A09.M2 43.43,96.27 44.2,95.5 66.55,95.5 67.56,96.52 A07.M2 68.83,97.28 69.6,98.04 v91.69,98.04 | v91.44,110.49 95,114.05 97.79,114.05 99.31,115.57 A05.E1
  Bottom 0.254: v91.44,110.49 91.69,110.24 v91.69,98.04
BBAC05  (via drill 0.61)
  Top 0.254: A09.N2 40.39,93.22 41.15,92.46 63.75,92.46 64.52,93.22 A07.N2 | v94.74,100.33 93.47,99.06 91.44,99.06 90.93,98.55 67.56,98.55 v65.53,96.52
  Bottom 0.254: v94.74,100.33 98.04,103.63 98.04,107.44 99.57,108.97 A05.H1 | v65.53,96.52 65.53,94.23 A07.N2
BBAC06  (via drill 0.61)
  Top 0.254: A09.S2 43.43,84.58 44.2,85.34 66.8,85.34 67.56,84.58 A07.S2 | v68.58,105.66 73.66,110.74 88.39,110.74 89.92,112.27 A05.F2
  Bottom 0.254: v68.58,105.66 67.06,104.14 67.06,85.6 67.82,84.84 A07.S2
BBAC07  (via drill 0.61)
  Top 0.254: 63.75,79.76 41.15,79.76 40.39,80.52 A09.T2 | 63.75,79.76 64.52,80.52 A07.T2 | v96.01,90.93 84.84,79.76 63.75,79.76
  Bottom 0.254: v96.01,90.93 98.04,92.96 98.04,101.09 99.57,102.62 A05.K1
BBAC08  (via drill 0.61)
  Top 0.254: 63.75,48.01 41.15,48.01 40.39,48.77 B09.D2 | 63.75,48.01 64.52,48.77 B07.D2 | v79.25,104.65 88.65,104.65 89.92,105.92 A05.J2 | v79.25,48.26 78.99,48.01 63.75,48.01
  Bottom 0.254: v79.25,48.26 v79.25,104.65
BBAC09  (via drill 0.61)
  Top 0.254: B09.E2 43.43,45.47 44.2,44.7 66.55,44.7 67.56,45.72 B07.E2 | v50.04,82.3 81.03,82.3 95.5,96.77 99.31,96.77 A05.M1
  Bottom 0.254: v50.04,82.3 44.2,76.45 44.2,47.75 43.18,46.74 B09.E2
BBAC10  (via drill 0.61)
  Top 0.254: B09.H2 43.43,39.12 44.2,38.35 66.55,38.35 67.56,39.37 B07.H2 | v89.66,97.03 78.49,85.85 v74.42,85.85
  Bottom 0.254: v89.66,97.03 89.66,98.81 90.17,99.31 A05.L2 | v74.42,85.85 72.64,84.07 72.64,45.97 68.58,41.91 68.58,40.39 B07.H2
BBAC11  (via drill 0.61)
  Top 0.254: 63.75,35.31 41.15,35.31 40.39,36.07 B09.J2 | 63.75,35.31 64.52,36.07 B07.J2 | v92.96,36.83 91.44,35.31 63.75,35.31
  Bottom 0.254: v92.96,36.83 92.46,37.34 92.46,55.12 98.04,60.71 98.04,88.39 99.57,89.92 A05.P1
BINIT  (via drill 0.61)
  Top 0.254: v94.49,72.39 95,72.9 131.06,72.9 131.57,73.41 139.95,73.41 140.72,74.17 A01.V2
  Bottom 0.254: B01.V2 141.73,5.33 142.75,6.35 142.75,23.62 142.49,23.88 142.49,73.15 141.73,73.91 A01.V2 | v94.49,72.39 95,72.9 95,95.5 94.23,96.27 A05.M2
BIOP1  (via drill 0.61)
  Top 0.254: B10.P2 30.73,20.07 31.5,19.3 91.95,19.3 92.96,20.32 B05.P2 94.23,20.07 98.81,20.07 99.57,19.3 104.65,19.3 105.66,20.32 B04.P2 106.93,21.08 108.71,21.08 110.74,23.11 112.01,23.11 112.52,22.61 141.99,22.61 v143.51,24.13 | v113.54,99.31 114.05,98.81 129.29,98.81 133.35,102.87 134.37,102.87 135.38,101.85 142.75,101.85 143.76,102.87 A01.K2 | v113.03,88.9 112.78,88.65 102.36,88.65 v93.98,80.26
  Bottom 0.254: v143.51,24.13 143.26,24.38 143.26,32 144.02,32.77 B01.K2 | v113.54,99.31 114.05,98.81 114.05,89.92 v113.03,88.9 | v93.98,80.26 92.46,78.74 92.46,55.88 91.95,55.37 91.95,22.61 93.22,21.34 B05.P2
BIOP2  (via drill 0.61)
  Top 0.254: 89.15,16.26 28.45,16.26 27.69,17.02 B10.R2 | 89.15,16.26 89.92,17.02 B05.R2 | 101.85,16.26 102.62,17.02 B04.R2 | 89.15,16.26 101.85,16.26 | 101.85,16.26 129.29,16.26 134.87,21.84 144.53,21.84 144.53,26.42 B01.M2 | v134.11,101.85 134.62,101.35 144.02,101.35 144.02,97.54 A01.M2 | v123.19,128.78 119.89,132.08 44.45,132.08 v37.59,125.22
  Bottom 0.254: v134.11,101.85 133.6,102.36 133.6,118.36 v123.19,128.78 | v37.59,125.22 25.65,113.28 25.65,18.8 26.42,18.03 B10.R2
BIOP4  (via drill 0.61)
  Top 0.254: 92.2,15.49 31.5,15.49 30.73,14.73 B10.S2 | 92.2,15.49 92.96,14.73 B05.S2 | 92.2,15.49 104.9,15.49 105.66,14.73 B04.S2 106.93,14.73 107.95,15.75 144.02,15.75 144.02,20.07 B01.P2 | v103.63,85.34 109.47,85.34 110.74,86.61 112.01,86.61 114.05,88.65 122.68,88.65 123.7,87.63 126.49,87.63 127.51,88.65 130.3,88.65 130.81,89.15 142.75,89.15 143.76,90.17 A01.P2
  Bottom 0.254: v103.63,85.34 101.85,83.57 101.85,76.96 102.11,76.71 102.11,75.44 101.85,75.18 101.85,33.27 105.16,29.97 105.16,15.75 105.92,14.99 B04.S2
BMB06  (via drill 0.61)
  Top 0.254: 92.2,40.89 31.5,40.89 30.73,40.13 B10.H2 | 92.2,40.89 92.96,40.13 B05.H2 | 104.9,40.89 105.66,40.13 B04.H2 | 92.2,40.89 104.9,40.89 | v131.32,41.4 130.81,40.89 104.9,40.89
  Bottom 0.254: v131.32,41.4 131.32,45.47 B02.E2 132.08,46.74 133.1,47.75 133.1,69.85 130.56,72.39 130.56,114.55 131.32,115.32 A02.E2
BMB07  (via drill 0.61)
  Top 0.254: 92.2,37.85 132.59,37.85 132.59,35.05 132.08,34.54 132.08,34.04 B02.K2 | 92.2,37.85 91.19,36.83 B05.J2 | 92.2,37.85 28.7,37.85 27.69,36.83 B10.J2 | v129.54,101.35 131.06,102.87 A02.K2
  Bottom 0.254: v129.54,101.35 130.05,100.84 130.05,72.14 130.3,71.88 130.3,35.05 131.32,34.04 B02.K2
BMB08  (via drill 0.61)
  Top 0.254: B10.K2 30.73,32.77 32,31.5 94.49,31.5 95,32 104.65,32 105.66,33.02 B04.K2 | v111,22.1 130.05,22.1 131.06,21.08 B02.P2 | v126.24,88.65 126.75,89.15 130.05,89.15 131.06,90.17 A02.P2 | v104.65,71.88 v126.75,71.88
  Bottom 0.254: v111,22.1 107.7,22.1 107.7,32 106.93,32.77 B04.K2 105.92,34.04 104.65,35.31 v104.65,71.88 | v126.24,88.65 126.75,88.14 v126.75,71.88
BMB10  (via drill 0.61)
  Top 0.254: A06.C1 87.88,121.67 88.65,120.9 111,120.9 112.01,121.92 A04.C1 | 125.98,75.95 v128.27,78.23 | v124.46,74.42 125.98,75.95 | v117.09,76.71 117.86,75.95 125.98,75.95
  Bottom 0.254: v124.46,74.42 124.21,74.17 124.21,39.12 126.75,36.58 126.75,12.95 128.02,11.68 B02.T2 | v128.27,78.23 128.27,80.26 A02.T2 | v117.09,76.71 117.09,121.67 113.28,121.67 A04.C1
BMB11  (via drill 0.61)
  Top 0.254: v86.61,106.43 84.84,106.43 A06.J1 | v91.44,76.2 94.23,73.41 127.25,73.41 128.02,74.17 A02.V2
  Bottom 0.254: B02.V2 129.03,5.33 129.79,6.1 129.79,71.63 129.03,72.39 129.03,73.91 A02.V2 | v86.61,106.43 86.11,105.92 86.11,81.53 v91.44,76.2
BR0  (via drill 0.61)
  Top 0.254: A12.L2 2.03,100.58 2.03,105.16 4.83,105.16 8.89,109.22 10.41,109.22 A12.H1 11.68,108.97 13.46,108.97 17.78,104.65 77.98,104.65 78.99,105.66 79.5,105.66 80.01,105.16 86.61,105.16 v87.88,106.43
  Bottom 0.254: v87.88,106.43 88.65,107.19 88.65,114.55 87.88,115.32 A06.E1
BR1
  Top 0.254: A06.L1 83.57,100.33 79.25,100.33 78.23,101.35 11.18,101.35 7.11,97.28 5.33,97.28 A12.M2
  Bottom 0.254: A12.M2 4.32,97.54 3.05,98.81 3.05,117.35 7.62,121.92 7.62,124.71 A12.B1
BR_CLK  (via drill 0.61)
  Top 0.254: v85.09,44.2 38.35,44.2 37.08,45.47 B10.E1
  Bottom 0.254: v85.09,44.2 85.6,44.7 85.6,71.37 85.09,71.88 85.09,73.66 85.6,74.17 85.6,107.7 | 85.6,107.7 86.87,108.97 A06.H1 | 85.6,107.7 85.6,123.7 84.58,124.71 A06.B1
BRP
  Bottom 0.254: B12.T2 2.03,11.68 3.56,13.21 3.56,76.45 4.32,77.22 A12.U2
CLOCKX
  Top 0.254: B07.N2 65.53,24.38 65.53,28.45 92.2,28.45 95.25,31.5 110.49,31.5 112.01,33.02 B04.K1
  Bottom 0.254: A07.D2 64.77,118.36 63.75,117.35 63.75,25.15 64.52,24.38 B07.N2
CLOCKY  (via drill 0.61)
  Top 0.254: v38.1,34.54 98.55,34.54 99.31,33.78 B05.K1
  Bottom 0.254: B09.N2 39.12,24.38 38.1,25.4 v38.1,34.54 38.1,117.09 39.37,118.36 A09.D2
DISPLAY
  Top 0.254: B12.H2 5.33,40.13 6.1,40.89 16,40.89 16.76,40.13 B11.H2 18.03,39.12 19.81,39.12 36.83,22.1 107.7,22.1 108.97,23.37 B04.N1
DISPP
  Top 0.254: A05.T2 89.92,80.52 88.65,79.25 30.48,79.25 13.46,96.27 11.68,96.27 A12.M1
  Bottom 0.254: 8.89,96.52 3.56,91.19 3.56,89.41 2.03,87.88 A12.R2 | 8.89,96.52 10.41,96.52 A12.M1 | 8.89,96.52 3.56,101.85 3.56,114.55 4.32,115.32 A12.E2
GND
  pour gnd$: 0,0 152.4,0 152.4,133.35 0,133.35
INT1
  Top 0.254: A12.D2 2.03,118.36 2.03,114.05 6.6,114.05 7.37,113.28 A12.F1
INT2
  Top 0.254: A12.K2 5.33,102.62 7.37,100.58 A12.L1
INT3
  Bottom 0.254: A12.P2 5.33,89.92 6.6,88.65 6.6,86.87 8.89,84.58 10.41,84.58 A12.S1
N$1
  Bottom 0.254: A05.R2 90.93,87.88 92.46,89.41 92.46,97.54 92.71,97.79 92.71,102.36 92.46,102.62 92.46,121.67 87.88,126.24 87.88,128.02 A06.A1
N$2
  Top 0.254: B11.K2 16.76,33.78 14.73,35.81 B11.J2
N$4
  Top 0.254: B12.K2 4.06,33.78 2.03,35.81 B12.J2
N$6
  Top 0.254: B11.E2 16.76,46.48 14.73,48.51 B11.D2
N$7
  Top 0.254: B12.E2 4.06,46.48 2.03,48.51 B12.D2
N$9
  Top 0.254: A05.A1 100.58,128.02 101.35,127.25 107.7,127.25 108.2,127.76 108.71,127.76 109.47,127 109.47,125.98 A04.B1
N$10
  Bottom 0.254: A05.C1 100.58,122.68 103.63,122.68 103.89,122.94 105.16,122.94 105.16,120.4 112.52,113.03 113.79,113.03 113.79,114.81 113.28,115.32 A04.E1
N$11  (via drill 0.61)
  Top 0.254: v102.62,115.06 99.06,118.62 97.54,118.62 A05.D1
  Bottom 0.254: v102.62,115.06 102.62,113.28 A04.F2
N$12  (via drill 0.61)
  Top 0.254: v111.25,112.78 109.98,114.05 98.55,114.05 97.54,113.03 A05.F1
  Bottom 0.254: v111.25,112.78 111.25,111.25 112.27,110.24 A04.H1
N$13  (via drill 0.61)
  Top 0.254: v102.62,109.22 101.09,110.74 92.96,110.74 91.69,109.47 91.19,109.47 90.42,110.24 90.42,111.51 91.19,111.51 93.22,113.54 93.22,115.32 A05.E2
  Bottom 0.254: v102.62,109.22 102.62,106.93 A04.J2
N$14
  Top 0.254: A05.N1 97.54,93.22 99.06,91.69 111,91.69 111.76,90.93 112.01,90.93 A04.P1
N$15  (via drill 0.61)
  Top 0.254: v95.76,98.04 v102.62,98.04
  Bottom 0.254: v95.76,98.04 93.73,100.08 93.73,102.62 A05.K2 | v102.62,98.04 102.62,94.23 A04.N2
N$16  (via drill 0.61)
  Top 0.254: v97.03,95.25 97.28,95 108.2,95 109.73,96.52 112.01,96.52 A04.M1
  Bottom 0.254: v97.03,95.25 97.03,99.31 A05.L1
N$17  (via drill 0.61)
  Top 0.254: v93.73,106.17 95.5,104.39 v102.62,104.39
  Bottom 0.254: v93.73,106.17 93.73,108.97 A05.H2 | v102.62,104.39 102.62,100.58 A04.L2
N$18
  Top 0.254: A05.J1 97.54,106.68 98.55,107.7 105.16,107.7 109.73,103.12 112.01,103.12 A04.K1
N$21  (via drill 0.61)
  Top 0.254: v84.58,57.4 120.4,57.4 121.67,56.13 B03.B1 | v84.07,108.2 v94.74,108.2 | v98.3,122.43 100.08,124.21 120.9,124.21 121.67,124.97 A03.B1
  Bottom 0.254: v84.58,57.4 82.8,59.18 82.8,100.58 83.31,101.09 83.31,105.41 82.8,105.92 82.8,106.93 v84.07,108.2 | v94.74,108.2 98.3,111.76 v98.3,122.43
N$22  (via drill 0.61)
  Top 0.254: v121.92,52.07 120.14,53.85 81.28,53.85 77.98,57.15 v74.42,57.15 | v75.95,112.78 77.72,114.55 90.42,114.55 96.27,120.4 120.9,120.4 121.67,119.63 A03.D1
  Bottom 0.254: v121.92,52.07 121.92,49.78 B03.D1 | v74.42,57.15 73.41,58.17 73.41,81.03 75.95,83.57 v75.95,112.78
N$23
  Bottom 0.254: B03.E1 125.73,46.74 125.73,50.8 126.75,51.82 126.75,70.61 125.48,71.88 125.48,75.95 124.21,77.22 124.21,114.55 124.97,115.32 A03.E1
N$24  (via drill 0.61)
  Top 0.254: v126.75,49.02 124.71,51.05 80.52,51.05 v77.72,53.85 | v78.23,102.36 78.74,101.85 81.53,101.85 82.04,102.36 86.36,102.36 86.87,101.85 88.14,101.85 93.47,107.19 95.76,107.19 96.77,108.2 111.51,108.2 112.01,107.7 120.4,107.7 121.92,109.22 124.71,109.22 A03.H1
  Bottom 0.254: v126.75,49.02 126.75,41.4 125.73,40.39 B03.H1 | v77.72,53.85 76.45,55.12 76.45,100.58 v78.23,102.36
N$26
  Bottom 0.254: B03.J1 122.68,37.08 123.44,37.85 123.44,102.11 122.17,103.38 122.17,105.66 A03.J1
N$27
  Bottom 0.254: B03.L1 121.67,30.73 120.9,31.5 120.9,70.1 121.41,70.61 121.41,73.66 120.9,74.17 120.9,98.3 121.92,99.31 A03.L1
N$28  (via drill 0.61)
  Top 0.254: v82.3,25.15 123.19,25.15 124.71,26.67 B03.M1 | v74.42,64.77 v68.58,70.61 | v111.25,131.06 112.52,129.79 119.63,129.79 v121.41,128.02
  Bottom 0.254: v82.3,25.15 75.95,25.15 75.95,63.25 v74.42,64.77 | v68.58,70.61 66.55,72.64 66.55,117.35 80.52,131.32 111.25,131.32 v111.25,131.06 | v121.41,128.02 126.75,122.68 126.75,98.55 125.73,97.54 A03.M1
N$29  (via drill 0.61)
  Top 0.254: v98.81,18.8 123.19,18.8 124.71,20.32 B03.P1 | v101.85,92.71 102.11,92.46 106.43,92.46 109.47,95.5 122.68,95.5 v125.22,92.96
  Bottom 0.254: v98.81,18.8 95,22.61 95,56.9 98.81,60.71 98.81,87.38 101.85,90.42 v101.85,92.71 | v125.22,92.96 125.22,91.19 A03.P1
N$30  (via drill 0.61)
  Top 0.254: v102.11,12.45 123.19,12.45 124.71,13.97 B03.S1 | v101.09,76.45 104.65,80.01 104.65,82.3 123.19,82.3 124.71,83.82 A03.S1
  Bottom 0.254: v102.11,12.45 101.35,13.21 101.35,76.2 v101.09,76.45
N$33
  Bottom 0.254: B03.D2 115.32,49.78 114.55,50.55 114.55,117.35 115.57,118.36 A03.D2
N$34
  Bottom 0.254: B03.E2 119.38,46.74 120.4,47.75 120.4,69.6 118.11,71.88 118.11,76.96 117.86,77.22 117.86,114.55 118.62,115.32 A03.E2
N$35  (via drill 0.61)
  Top 0.254: v84.58,39.88 86.11,38.35 117.35,38.35 118.36,39.37 B03.H2 | v95,112.78 96.52,111.25 109.22,111.25 112.27,108.2 117.35,108.2 118.36,109.22 A03.H2
  Bottom 0.254: v84.58,39.88 82.8,41.66 82.8,47.5 79.76,50.55 79.76,103.89 82.3,106.43 82.3,126.24 85.85,129.79 95,129.79 v95,112.78
N$36  (via drill 0.61)
  Top 0.254: v118.11,11.43 116.59,9.91 v68.33,9.91 | v51.05,120.14 55.12,124.21 72.64,124.21 78.74,130.3 v109.22,130.3
  Bottom 0.254: v118.11,11.43 117.86,11.68 117.86,27.69 119.13,28.96 119.13,32.77 B03.K2 | v68.33,9.91 51.05,27.18 v51.05,120.14 | v109.22,130.3 120.4,119.13 120.4,107.19 119.38,106.17 119.38,103.89 A03.K2
N$37  (via drill 0.61)
  Top 0.254: v55.88,30.48 63.75,22.61 78.49,22.61 82.04,26.16 83.31,26.16 83.82,25.65 117.35,25.65 118.36,26.67 B03.M2 | v55.88,73.91 57.91,75.95 88.14,75.95 98.04,85.85 98.04,91.95 96.77,91.95 95.5,93.22 95.5,96.01 96.52,96.01 96.77,96.27 98.81,96.27 99.57,95.5 101.35,95.5 v106.17,100.33 | v113.03,94.49 113.54,95 118.36,95 v118.87,94.49
  Bottom 0.254: v55.88,30.48 54.36,32 54.36,72.39 v55.88,73.91 | v106.17,100.33 106.68,100.84 106.68,101.6 108.2,103.12 108.2,106.93 108.97,107.7 111.25,107.7 111.25,105.16 111.51,104.9 111.51,96.01 v113.03,94.49 | v118.87,94.49 118.87,96.27 A03.M2
N$38  (via drill 0.61)
  Top 0.254: v116.08,21.08 118.36,21.08 B03.P2 | v113.03,92.96 113.54,92.46 118.36,92.46 v118.87,92.96
  Bottom 0.254: v116.08,21.08 114.05,23.11 114.05,40.89 111.76,43.18 111.76,45.21 111.51,45.47 111.51,84.84 112.01,85.34 112.01,89.41 111.51,89.92 111.51,91.44 v113.03,92.96 | v118.87,92.96 118.87,91.19 A03.P2
N$39  (via drill 0.61)
  Top 0.254: v90.93,12.95 100.58,12.95 101.09,13.46 102.36,13.46 102.87,12.95 117.35,12.95 118.36,13.97 B03.S2 | v89.15,62.48 96.01,69.34 v108.71,69.34 | v109.98,83.31 110.49,82.8 117.35,82.8 118.36,83.82 A03.S2
  Bottom 0.254: v90.93,12.95 89.15,14.73 v89.15,62.48 | v108.71,69.34 108.2,69.85 108.2,81.53 v109.98,83.31
N$40  (via drill 0.61)
  Top 0.254: v88.14,60.2 88.39,60.45 v118.87,60.45
  Bottom 0.254: v88.14,60.2 88.65,59.69 88.65,6.6 106.93,6.6 110.74,10.41 110.74,10.67 115.32,10.67 B03.T2 | v118.87,60.45 119.13,60.71 119.13,70.1 117.6,71.63 117.6,74.93 116.08,76.45 116.08,80.26 A03.T2
N$41
  Bottom 0.254: B03.V2 116.33,5.33 117.09,6.1 117.09,73.15 116.33,73.91 A03.V2
N$42
  Bottom 0.254: B02.D2 128.02,49.78 127.25,50.55 127.25,71.12 127.76,71.63 127.76,73.66 127.25,74.17 127.25,117.35 128.27,118.36 A02.D2
N$43  (via drill 0.61)
  Top 0.254: v131.57,35.31 108.2,35.31 v106.68,36.83 | v105.16,75.95 105.16,80.52 108.2,80.52 108.97,79.76 136.65,79.76 v137.92,81.03
  Bottom 0.254: v131.57,35.31 133.1,33.78 133.1,14.73 137.41,14.73 B02.S1 | v106.68,36.83 105.16,38.35 105.16,70.1 105.66,70.61 105.66,75.44 v105.16,75.95 | v137.92,81.03 137.92,83.57 A02.S1
N$44
  Bottom 0.254: B02.J1 135.38,37.08 135.38,41.4 136.14,42.16 136.14,101.09 134.87,102.36 134.87,105.66 A02.J1
N$45  (via drill 0.61)
  Top 0.254: v125.73,25.15 135.89,25.15 137.41,26.67 B02.M1 | v112.78,114.05 v137.92,114.05
  Bottom 0.254: v125.73,25.15 120.4,19.81 120.4,7.37 116.59,3.56 73.15,3.56 73.15,33.02 67.06,39.12 67.06,55.63 70.61,59.18 70.61,73.66 70.1,74.17 70.1,114.81 85.6,130.3 105.16,130.3 105.16,125.22 107.7,122.68 107.7,119.13 v112.78,114.05 | v137.92,114.05 139.45,112.52 139.45,101.85 138.18,100.58 138.18,97.54 A02.M1
N$46  (via drill 0.61)
  Top 0.254: v149.86,50.29 149.86,50.8 148.84,51.82 148.84,76.45 v141.73,76.45 | v140.97,79.25 137.92,82.3 133.6,82.3 132.33,83.57 A02.S2
  Bottom 0.254: v149.86,50.29 149.61,50.04 149.61,42.16 149.1,41.66 149.1,27.18 143.26,21.34 143.26,3.56 140.72,3.56 136.91,7.37 136.91,13.72 132.33,13.72 B02.S2 | v141.73,76.45 140.97,77.22 v140.97,79.25
N$47  (via drill 0.61)
  Top 0.254: v62.74,70.61 71.88,61.47 134.37,61.47 134.37,56.13 B02.B1
  Bottom 0.254: v62.74,70.61 63.25,71.12 63.25,121.67 71.63,130.05 71.63,131.32 72.9,132.59 134.37,132.59 134.37,125.98 A02.B1
N$48  (via drill 0.61)
  Top 0.254: v69.6,60.71 75.18,60.71 81.53,54.36 134.37,54.36 134.37,49.78 B02.D1 | v69.6,119.13 77.22,126.75 v108.46,126.75 | v114.3,118.87 115.32,117.86 133.6,117.86 134.37,118.62 A02.D1
  Bottom 0.254: v69.6,60.71 v69.6,119.13 | v108.46,126.75 111.51,126.75 111.51,121.67 v114.3,118.87
N$49
  Bottom 0.254: B02.E1 138.43,46.74 139.45,47.75 139.45,60.45 138.18,61.72 138.18,75.95 136.91,77.22 136.91,114.55 137.67,115.32 A02.E1
N$50  (via drill 0.61)
  Top 0.254: v139.45,44.2 143.26,48.01 148.34,48.01 148.84,48.51 148.84,51.05 140.21,59.69 v140.21,60.96 | v138.94,85.6 140.72,83.82 v140.97,83.82
  Bottom 0.254: v139.45,44.2 139.45,12.95 140.72,11.68 B01.T2 | v140.21,60.96 139.45,61.72 139.45,85.09 v138.94,85.6 | v140.97,83.82 140.97,81.53 A01.T2
N$51  (via drill 0.61)
  Top 0.254: v141.73,14.73 143.76,14.73 B01.S2 | v140.97,44.45 141.22,44.2 144.02,44.2 145.03,43.18 145.54,43.18 v150.88,48.51 | v149.86,82.8 149.1,83.57 145.03,83.57 A01.S2
  Bottom 0.254: v141.73,14.73 139.95,16.51 139.95,43.43 v140.97,44.45 | v150.88,48.51 150.88,50.55 149.61,51.82 149.61,82.55 v149.86,82.8
VCC
  pour vcc$: 0,0 152.4,0 152.4,133.35 0,133.35